# Altium project PV Refridgerator.PrjPCB
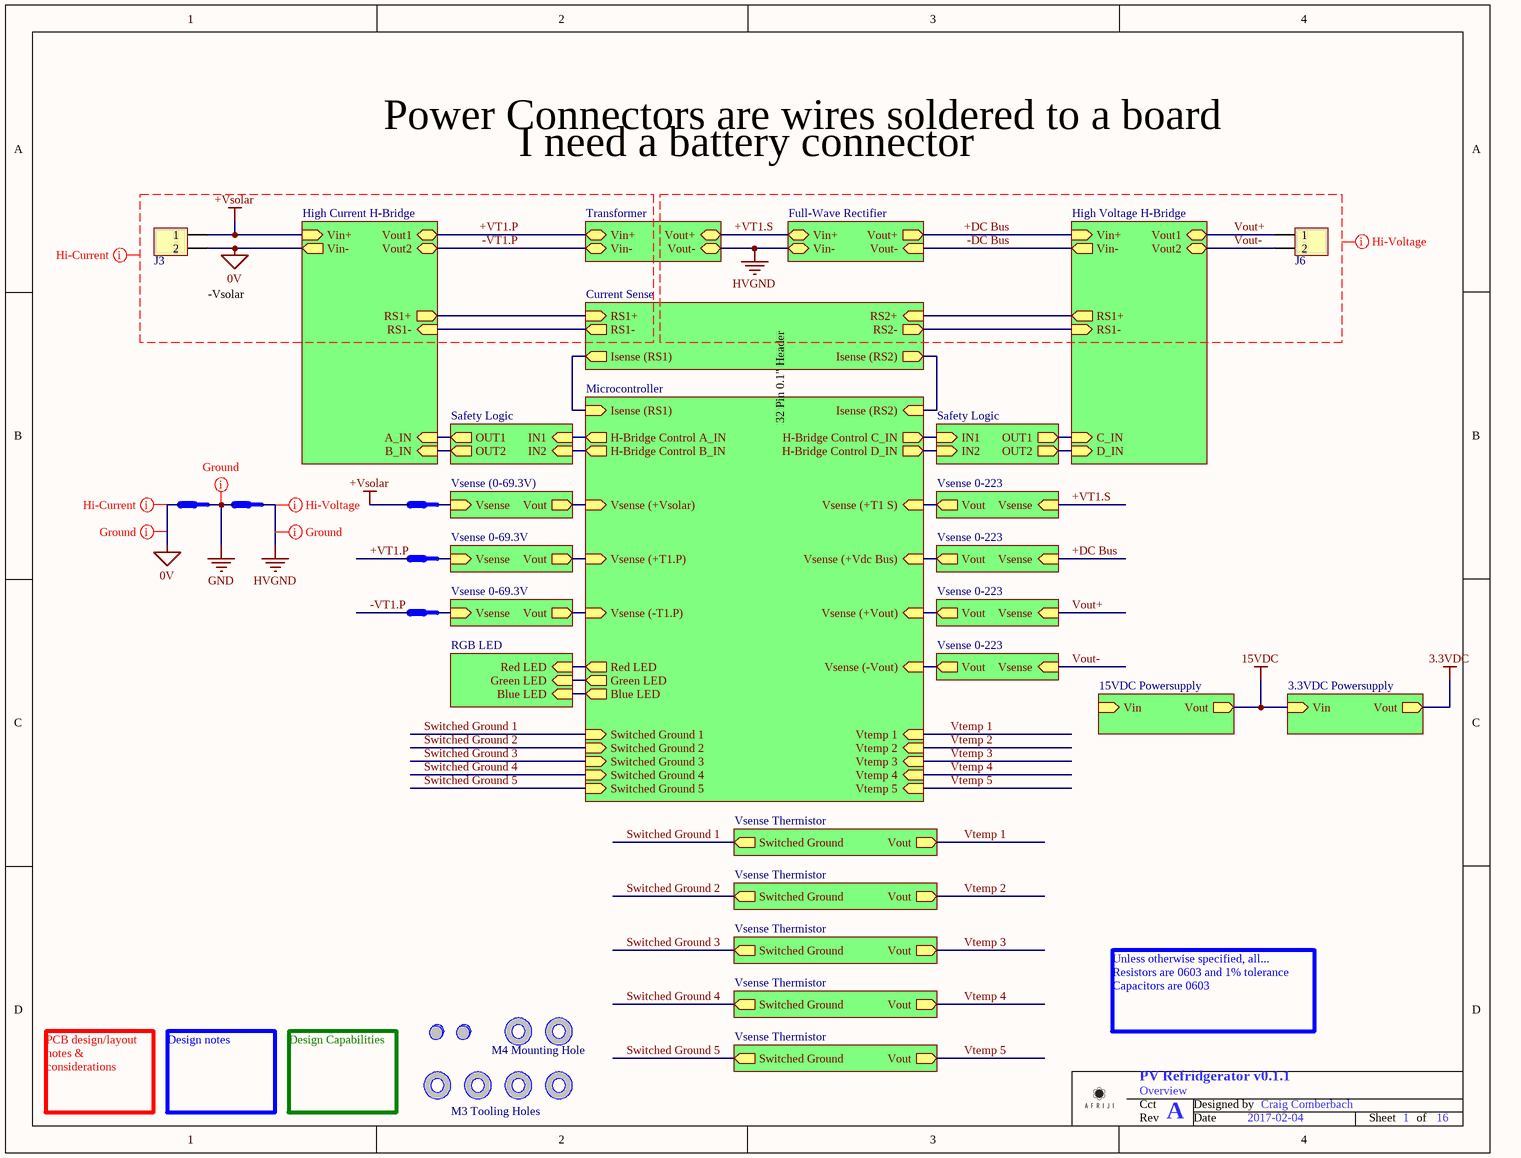
[diagram p0: Overview.SchDoc]
Designer: Craig Comberbach; ProjectRevision: v0.1.1; ProjectTitle: PV Refridgerator
8 sheets, 62 parts. Net scope: hierarchical (ports join the sheet entries above them; power ports are global).
Board file: PV Refridgerator v0.1.1.PCBDOC
Sheets:
  Overview.SchDoc
    High Current H-Bridge = High Current H-Bridge.SchDoc
    High Voltage H-Bridge = High Voltage H-Bridge.SchDoc
    3.3VDC Powersupply = 3.3VDC Powersupply.SchDoc
    Microcontroller = Microcontroller.SchDoc
      ICSP = ICSP.SchDoc
    15VDC Powersupply = 15VDC Powersupply.SchDoc
    Safety Logic = Safety Logic.SchDoc
    Safety Logic = Safety Logic.SchDoc

## Sheet Overview.SchDoc: Overview
size Letter; Date: 2017-02-04; DocumentNumber: 1; Revision: A; SheetNumber: 1; SheetTotal: 16; DesignedBy: Craig Comberbach

### Parts
FD1  Fiducial, Double Sided  [Fiducial - Double sided]  (value not drawn)
FD2  Fiducial, Double Sided  [Fiducial - Double sided]  (value not drawn)
J3  Terminal Block - 2-Position HiV/HiA  [TE 796739-2]  (value not drawn)
J6  Terminal Block - 2-Position HiV/HiA  [TE 796739-2]  (value not drawn)
MountingHole1  M3 Tooling Holes  [M3 Screw - One Sided]  (no BOM)
MountingHole2  Mounting Hole  [M3 Screw - One Sided]  (value not drawn)  (no BOM)
MountingHole3  Mounting Hole  [M4 Screw - One Sided]  (value not drawn)  (no BOM)
MountingHole4  M4 Mounting Hole  [M4 Screw - One Sided]  (no BOM)
MountingHole5  Mounting Hole  [M3 Screw - One Sided]  (value not drawn)  (no BOM)
MountingHole6  Mounting Hole  [M3 Screw - One Sided]  (value not drawn)  (no BOM)
NetTie2  Net Tie  [Net tie (7/50 mil)]  (value not drawn)  (net tie, no BOM)
NetTie3  Net Tie  [Net tie (7/7 mil)]  (value not drawn)  (net tie, no BOM)
NetTie7  Net Tie  [Net tie (7/7 mil)]  (value not drawn)  (net tie, no BOM)
NetTie8  Net Tie  [Net tie (7/7 mil)]  (value not drawn)  (net tie, no BOM)
NetTie9  Net Tie  [Net tie (7/7 mil)]  (value not drawn)  (net tie, no BOM)

### Sub-sheets
3.3VDC Powersupply = 3.3VDC Powersupply.SchDoc: Vin (in), Vout (out)
15VDC Powersupply = 15VDC Powersupply.SchDoc: Vin (in), Vout (out)
Current Sense = Current Sense.SchDoc (file not in this document): RS1+ (in), RS1- (out), RS2+ (in), RS2- (out), Isense (RS1) (out), Isense (RS2) (out)
Full-Wave Rectifier = Full-Wave Rectifier.SchDoc (file not in this document): Vin+ (bidir), Vin- (bidir), Vout+ (out), Vout- (in)
High Current H-Bridge = High Current H-Bridge.SchDoc: Vout1 (bidir), Vout2 (bidir), Vin+ (in), Vin- (out), A_IN (in), B_IN (in), RS1+ (out), RS1- (in)
High Voltage H-Bridge = High Voltage H-Bridge.SchDoc: Vout1 (bidir), Vout2 (bidir), Vin+ (in), Vin- (out), C_IN (in), D_IN (in), RS1+ (out), RS1- (in)
Microcontroller = Microcontroller.SchDoc: H-Bridge Control A_IN (out), H-Bridge Control B_IN (out), H-Bridge Control C_IN (out), H-Bridge Control D_IN (out), Red LED (out), Green LED (out), Blue LED (out), Vsense (+T1.P) (in), Vsense (+Vsolar) (in), Vsense (-T1.P) (in), Vsense (+T1 S) (in), Vsense (+Vdc Bus) (in), Vsense (+Vout) (in), Vsense (-Vout) (in), Vtemp 1 (in), Vtemp 2 (in), Vtemp 3 (in), Vtemp 4 (in), Vtemp 5 (in), Isense (RS1) (in), Isense (RS2) (in), Switched Ground 1 (in), Switched Ground 2 (in), Switched Ground 3 (in), Switched Ground 4 (in), Switched Ground 5 (in)
RGB LED = RGB LED.SchDoc (file not in this document): Red LED (in), Green LED (in), Blue LED (in)
Safety Logic = Safety Logic.SchDoc: IN1 (in), IN2 (in), OUT1 (out), OUT2 (out)
Safety Logic = Safety Logic.SchDoc: IN1 (in), IN2 (in), OUT1 (out), OUT2 (out)
Transformer = Transformer.SchDoc (file not in this document): Vin+ (bidir), Vin- (bidir), Vout+ (bidir), Vout- (bidir)
Vsense 0-69.3V = Vsense 0-69.3V.SchDoc (file not in this document): Vsense (in), Vout (out)
Vsense 0-69.3V = Vsense 0-69.3V.SchDoc (file not in this document): Vsense (in), Vout (out)
Vsense 0-223 = Vsense 0-223.3V.SchDoc (file not in this document): Vsense (in), Vout (out)
Vsense 0-223 = Vsense 0-223.3V.SchDoc (file not in this document): Vsense (in), Vout (out)
Vsense 0-223 = Vsense 0-223.3V.SchDoc (file not in this document): Vsense (in), Vout (out)
Vsense 0-223 = Vsense 0-223.3V.SchDoc (file not in this document): Vsense (in), Vout (out)
Vsense (0-69.3V) = Vsense 0-69.3V.SchDoc (file not in this document): Vsense (in), Vout (out)
Vsense Thermistor = Vsense Thermistor.SchDoc (file not in this document): Switched Ground (out), Vout (out)
Vsense Thermistor = Vsense Thermistor.SchDoc (file not in this document): Switched Ground (out), Vout (out)
Vsense Thermistor = Vsense Thermistor.SchDoc (file not in this document): Switched Ground (out), Vout (out)
Vsense Thermistor = Vsense Thermistor.SchDoc (file not in this document): Switched Ground (out), Vout (out)
Vsense Thermistor = Vsense Thermistor.SchDoc (file not in this document): Switched Ground (out), Vout (out)

### Nets
0V: J3.2 NetTie2.2 ; sheet High Current H-Bridge/Vin-, sheet High Current H-Bridge/RS1-, sheet Current Sense/RS1-
15VDC: sheet 3.3VDC Powersupply/Vin, sheet 15VDC Powersupply/Vout
+Vsolar: J3.1 NetTie7.2 ; sheet High Current H-Bridge/Vin+
GND: NetTie2.1 NetTie3.2
HVGND: NetTie3.1 ; sheet Full-Wave Rectifier/Vin-, sheet Transformer/Vout-
+DC Bus: sheet Full-Wave Rectifier/Vout+, sheet High Voltage H-Bridge/Vin+, sheet Vsense 0-223/Vsense
+VT1.P: NetTie8.2 ; sheet High Current H-Bridge/Vout1, sheet Transformer/Vin+
+VT1.S: sheet Full-Wave Rectifier/Vin+, sheet Transformer/Vout+, sheet Vsense 0-223/Vsense
-DC Bus: sheet Full-Wave Rectifier/Vout-, sheet High Voltage H-Bridge/Vin-, sheet High Voltage H-Bridge/RS1-, sheet Current Sense/RS2-
-VT1.P: NetTie9.2 ; sheet High Current H-Bridge/Vout2, sheet Transformer/Vin-
Switched Ground 1: sheet Microcontroller/Switched Ground 1, sheet Vsense Thermistor/Switched Ground
Switched Ground 2: sheet Microcontroller/Switched Ground 2, sheet Vsense Thermistor/Switched Ground
Switched Ground 3: sheet Microcontroller/Switched Ground 3, sheet Vsense Thermistor/Switched Ground
Switched Ground 4: sheet Microcontroller/Switched Ground 4, sheet Vsense Thermistor/Switched Ground
Switched Ground 5: sheet Microcontroller/Switched Ground 5, sheet Vsense Thermistor/Switched Ground
Vout+: J6.1 ; sheet High Voltage H-Bridge/Vout1, sheet Vsense 0-223/Vsense  [project net C_VS]
Vout-: J6.2 ; sheet High Voltage H-Bridge/Vout2, sheet Vsense 0-223/Vsense  [project net D_VS]
Vtemp 1: sheet Microcontroller/Vtemp 1, sheet Vsense Thermistor/Vout
Vtemp 2: sheet Microcontroller/Vtemp 2, sheet Vsense Thermistor/Vout
Vtemp 3: sheet Microcontroller/Vtemp 3, sheet Vsense Thermistor/Vout
Vtemp 4: sheet Microcontroller/Vtemp 4, sheet Vsense Thermistor/Vout
Vtemp 5: sheet Microcontroller/Vtemp 5, sheet Vsense Thermistor/Vout
NetNetTie7_1: NetTie7.1 ; sheet Vsense (0-69.3V)/Vsense
NetNetTie8_1: NetTie8.1 ; sheet Vsense 0-69.3V/Vsense
NetNetTie9_1: NetTie9.1 ; sheet Vsense 0-69.3V/Vsense
NetQ3_2: sheet High Current H-Bridge/RS1+, sheet Current Sense/RS1+
NetQ7_2: sheet High Voltage H-Bridge/RS1+, sheet Current Sense/RS2+
NetU1_4: sheet Microcontroller/H-Bridge Control C_IN, sheet Safety Logic/IN1
NetU1_5: sheet Microcontroller/H-Bridge Control D_IN, sheet Safety Logic/IN2
NetU1_14: sheet Microcontroller/Vsense (-T1.P), sheet Vsense 0-69.3V/Vout
NetU1_15: sheet Microcontroller/Vsense (+T1.P), sheet Vsense 0-69.3V/Vout
NetU1_16: sheet Microcontroller/Vsense (+Vsolar), sheet Vsense (0-69.3V)/Vout
NetU1_22: sheet Microcontroller/Isense (RS1), sheet Current Sense/Isense (RS1)
NetU1_23: sheet Microcontroller/Isense (RS2), sheet Current Sense/Isense (RS2)
NetU1_27: sheet Microcontroller/Vsense (+Vdc Bus), sheet Vsense 0-223/Vout
NetU1_28: sheet Microcontroller/Vsense (+T1 S), sheet Vsense 0-223/Vout
NetU1_29: sheet Microcontroller/Vsense (+Vout), sheet Vsense 0-223/Vout
NetU1_30: sheet Microcontroller/Vsense (-Vout), sheet Vsense 0-223/Vout
NetU1_43: sheet Microcontroller/Red LED, sheet RGB LED/Red LED
NetU1_44: sheet Microcontroller/Green LED, sheet RGB LED/Green LED
NetU1_45: sheet Microcontroller/Blue LED, sheet RGB LED/Blue LED
NetU1_52: sheet Microcontroller/H-Bridge Control A_IN, sheet Safety Logic/IN1
NetU1_53: sheet Microcontroller/H-Bridge Control B_IN, sheet Safety Logic/IN2
NetU3A_4: sheet High Current H-Bridge/A_IN, sheet Safety Logic/OUT1
NetU3B_4: sheet High Voltage H-Bridge/C_IN, sheet Safety Logic/OUT1
NetU7A_4: sheet High Current H-Bridge/B_IN, sheet Safety Logic/OUT2
NetU7B_4: sheet High Voltage H-Bridge/D_IN, sheet Safety Logic/OUT2

### Layout directives
net class 15A: 0V, +Vsolar, +VT1.P, -VT1.P
net class 171-250V: +DC Bus, +VT1.S, -DC Bus, HVGND, Vout+, Vout-
net class Grounds: 0V, GND, HVGND

### Notes on the sheet
- Power Connectors are wires soldered to a board
- I need a battery connector
- (near J3) -Vsolar
- 32 Pin 0.1" Header
- Unless otherwise specified, all...
  Resistors are 0603 and 1% tolerance
  Capacitors are 0603
- PCB design/layout notes & considerations
- Design notes
- Design Capabilities
- Cct
- Designed by
- Rev
- Date
- Sheet
- of

### Library data of the parts
J3 J6 = Terminal Block - 2-Position HiV/HiA: Manufacturer: TE Connectivity AMP Connectors; Manufacturer Part Number: 796739-2; Number of Levels: 1; Positions Per Level: 2; Pitch: 0.375" (9.53mm); Mating Orientation: Horizontal with Board; Current: 30A; Voltage: 600V; Wire Gauge: 10-30 AWG; Wire Termination: Screw - Rising Cage Clamp; Clamp Material - Plating: Brass - Nickel Plated; Torque - Screw: 0.79 Nm (7.0 Lb-In); Screw Thread: M3; Supplier 1: Digi-Key; RoHS: RoHS Compliant; Category: Connectors, Interconnects; Stock 1: 14124; Pricing 1: 1=2.21, 10=1.673, 25=1.5504, 50=1.394, 100=1.36, 250=1.19, 500=1.088, 1000=0.986, 2500=0.884 (USD); Packaging: Tray; Part Status: Active; Mounting Type: Through Hole; Features: Interlocking (Side); Color: Green; Operating Temperature: -; Housing Material: Polyamide (PA66), Nylon 6/6; Contact Material - Plating: -; Screw Material - Plating: Brass - Nickel Plated; ComponentLink1URL: http://www.te.com/commerce/DocumentDelivery/DDEController?Action=srchrtrv&DocNm=796739&DocType=Customer+Drawing&DocLang=English; ComponentLink1Description: Spec Sheet; Supplier Part Number 1: A98273-ND
MountingHole1 MountingHole4 = Mounting Hole
NetTie2 NetTie3 NetTie7-NetTie9 = Net Tie: Ties two nets together
FD1 FD2 = Fiducial, Double Sided: Technology: Mechanical

## Sheet High Current H-Bridge.SchDoc: High Current H-Bridge
size Letter; Date: 2017-01-26; DocumentNumber: 2; Revision: A; SheetNumber: 2; SheetTotal: 16; DesignedBy: Mike MacKay
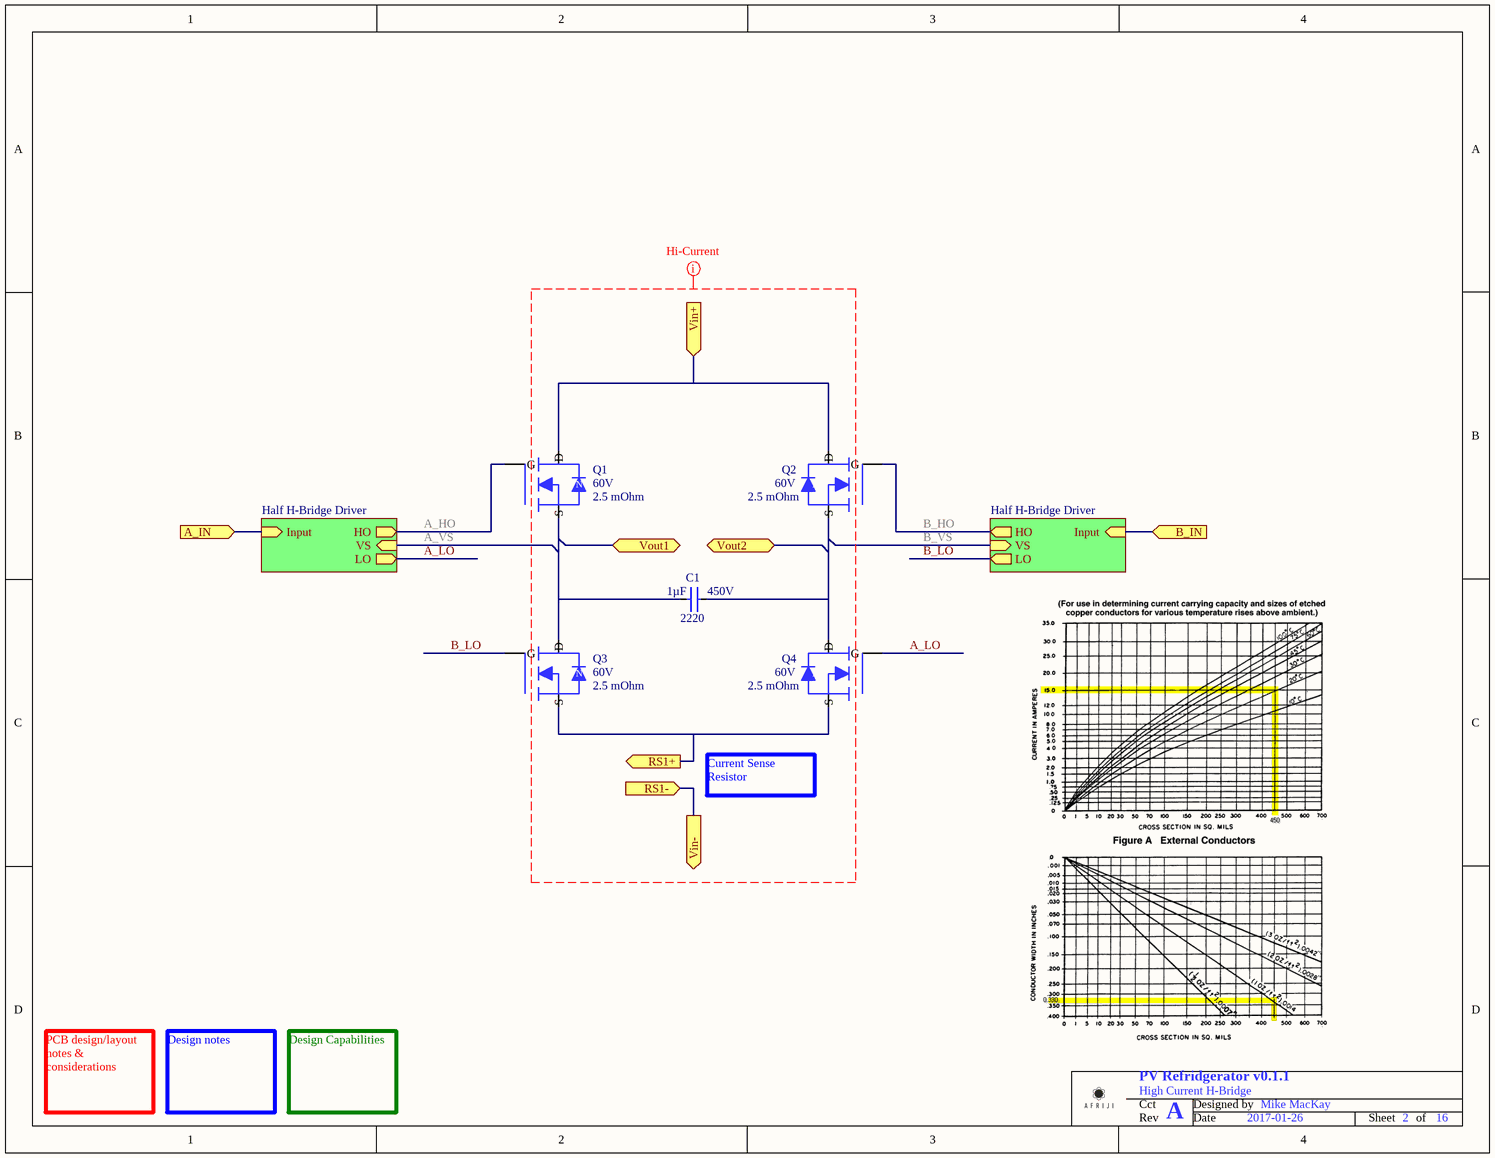
[diagram p1: High Current H-Bridge.SchDoc]

### Parts
C1  Capacitance: 1µF  Voltage - Rated: 450V  Package / Case: 2220  [C2220 - Ceramic]  (hidden comment: 1uF 2220 450V)
Q1  Drain to Source Voltage (Vdss): 60V  Rds On (Max) @ Id, Vgs: 2.5 mOhm  [DPAK]  (hidden comment: N-MOSFET - 66A/25V)
Q2  Drain to Source Voltage (Vdss): 60V  Rds On (Max) @ Id, Vgs: 2.5 mOhm  [DPAK]  (hidden comment: N-MOSFET - 66A/25V)
Q3  Drain to Source Voltage (Vdss): 60V  Rds On (Max) @ Id, Vgs: 2.5 mOhm  [DPAK]  (hidden comment: N-MOSFET - 66A/25V)
Q4  Drain to Source Voltage (Vdss): 60V  Rds On (Max) @ Id, Vgs: 2.5 mOhm  [DPAK]  (hidden comment: N-MOSFET - 66A/25V)

### Sub-sheets
Half H-Bridge Driver = Half H-Bridge Driver.SchDoc (file not in this document): HO (out), VS (in), LO (out), Input (in)
Half H-Bridge Driver = Half H-Bridge Driver.SchDoc (file not in this document): HO (out), VS (in), LO (out), Input (in)

### Ports
A_IN (in), B_IN (in), RS1+ (out), RS1- (in), Vin+ (in), Vin- (out), Vout1 (bidir), Vout2 (bidir)

### Nets
0V: port Vin-, port RS1-
+Vsolar: Q1.3(D) Q2.3(D) ; port Vin+
A_HO: Q1.1(G) ; sheet Half H-Bridge Driver/HO
A_LO: Q4.1(G) ; sheet Half H-Bridge Driver/LO
A_VS: C1.1 Q1.2(S) Q3.3(D) ; port Vout1, sheet Half H-Bridge Driver/VS  [project net +VT1.P]
B_HO: Q2.1(G) ; sheet Half H-Bridge Driver/HO
B_LO: Q3.1(G) ; sheet Half H-Bridge Driver/LO
B_VS: C1.2 Q2.2(S) Q4.3(D) ; port Vout2, sheet Half H-Bridge Driver/VS  [project net -VT1.P]
NetQ3_2: Q3.2(S) Q4.2(S) ; port RS1+
NetU3A_4: port A_IN, sheet Half H-Bridge Driver/Input
NetU7A_4: port B_IN, sheet Half H-Bridge Driver/Input

### Layout directives
net class 15A: (no net found under the mark)

### Notes on the sheet
- Current Sense Resistor
- PCB design/layout notes & considerations
- Design notes
- Design Capabilities
- Cct
- Designed by
- Rev
- Date
- Sheet
- of
- (in symbol N-MOSFET - 66A/25V) N

### Library data of the parts
C1 = 1uF 2220 450V: Manufacturer: TDK Corporation; Manufacturer Part Number: CGA9P4X7T2W105M250KE; Tolerance: ±20%; Temperature Coefficient: X7T; Supplier 1: Digi-Key; Supplier Part Number 1: 445-7998-1-ND; RoHS: RoHS Compliant; Category: Capacitors; Stock 1: 10247; Pricing 1: 1=3.11, 10=2.576, 100=2.1589, 250=1.78012 (USD); Packaging: Cut Tape (CT); Part Status: Active; Operating Temperature: -55°C ~ 125°C; Features: Soft Termination; Ratings: AEC-Q200; Applications: Automotive, Boardflex Sensitive; Failure Rate: -; Mounting Type: Surface Mount, MLCC; Size / Dimension: 0.224" L x 0.197" W (5.70mm x 5.00mm); Height - Seated (Max): -; Thickness (Max): 0.098" (2.50mm); Lead Spacing: -; Lead Style: -; ComponentLink1URL: https://product.tdk.com/info/en/catalog/datasheets/mlcc_automotive_soft_en.pdf; ComponentLink1Description: Spec Sheet; Value: 1uF 2220 450V
Q1-Q4 = N-MOSFET - 66A/25V: Manufacturer: Infineon Technologies; Manufacturer Part Number: IPD025N06N; FET Type: N-Channel; Current - Continuous Drain (Id) @ 25°C: 90A; Drive Voltage (Max Rds On,  Min Rds On): 6V, 10V; Vgs(th) (Max) @ Id: 2.8V @ 95µA; Gate Charge (Qg) (Max) @ Vgs: 71nC @ 10V; Input Capacitance (Ciss) (Max) @ Vds: 5200pF @ 30V; Vgs (Max): ±20V; Power Dissipation (Max): 3W (Ta), 167W (Tc); Supplier 1: Digi-Key; Supplier Part Number 1: IPD025N06NCT-ND; RoHS: RoHS Compliant; Category: Discrete Semiconductor Products; Stock 1: 5405; Pricing 1: 1=1.91, 10=1.72, 100=1.3822, 500=1.13558, 1000=0.94091 (USD); Packaging: Cut Tape (CT); Part Status: Active; Technology: MOSFET (Metal Oxide); FET Feature: -; Operating Temperature: -55°C ~ 175°C (TJ); Mounting Type: Surface Mount; Supplier Device Package: PG-TO252-3; Package / Case: TO-252-3, DPak (2 Leads + Tab), SC-63; ComponentLink1URL: http://www.infineon.com/dgdl/IPD025N06N_Rev2+1.pdf?folderId=db3a304313b8b5a60113cee8763b02d7&fileId=db3a304336415dec0136531648062c76; ComponentLink1Description: Spec Sheet

## Sheet High Voltage H-Bridge.SchDoc: High Voltage H-Bridge
size Letter; Date: 2017-01-26; DocumentNumber: 7; Revision: A; SheetNumber: 7; SheetTotal: 16; DesignedBy: Mike MacKay
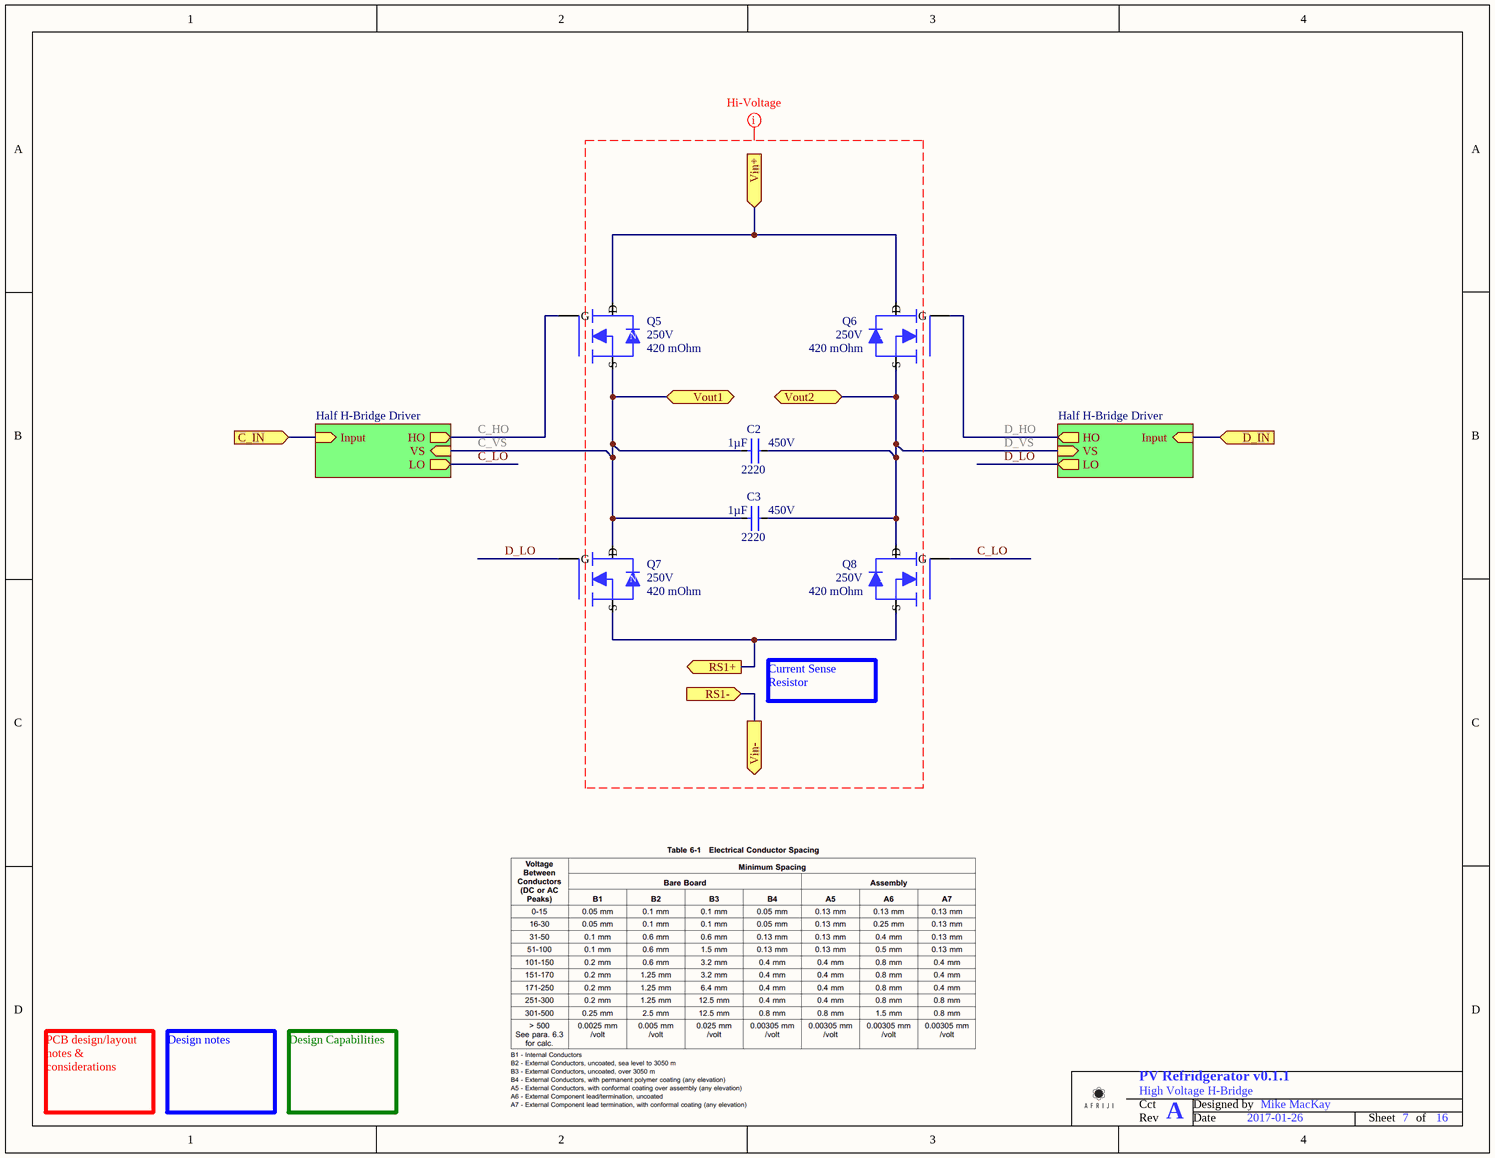
[diagram p2: High Voltage H-Bridge.SchDoc]

### Parts
C2  Capacitance: 1µF  Voltage - Rated: 450V  Package / Case: 2220  [C2220 - Ceramic]  (hidden comment: 1uF 2220 450V)
C3  Capacitance: 1µF  Voltage - Rated: 450V  Package / Case: 2220  [C2220 - Ceramic]  (hidden comment: 1uF 2220 450V)
Q5  Drain to Source Voltage (Vdss): 250V  Rds On (Max) @ Id, Vgs: 420 mOhm  [DPAK]  (hidden comment: N-MOSFET - 66A/25V)
Q6  Drain to Source Voltage (Vdss): 250V  Rds On (Max) @ Id, Vgs: 420 mOhm  [DPAK]  (hidden comment: N-MOSFET - 66A/25V)
Q7  Drain to Source Voltage (Vdss): 250V  Rds On (Max) @ Id, Vgs: 420 mOhm  [DPAK]  (hidden comment: N-MOSFET - 66A/25V)
Q8  Drain to Source Voltage (Vdss): 250V  Rds On (Max) @ Id, Vgs: 420 mOhm  [DPAK]  (hidden comment: N-MOSFET - 66A/25V)

### Sub-sheets
Half H-Bridge Driver = Half H-Bridge Driver.SchDoc (file not in this document): HO (out), VS (in), LO (out), Input (in)
Half H-Bridge Driver = Half H-Bridge Driver.SchDoc (file not in this document): HO (out), VS (in), LO (out), Input (in)

### Ports
C_IN (in), D_IN (in), RS1+ (out), RS1- (in), Vin+ (in), Vin- (out), Vout1 (bidir), Vout2 (bidir)

### Nets
+DC Bus: Q5.3(D) Q6.3(D) ; port Vin+
-DC Bus: port Vin-, port RS1-
C_HO: Q5.1(G) ; sheet Half H-Bridge Driver/HO
C_LO: Q8.1(G) ; sheet Half H-Bridge Driver/LO
C_VS: C2.1 C3.1 Q5.2(S) Q7.3(D) ; port Vout1, sheet Half H-Bridge Driver/VS
D_HO: Q6.1(G) ; sheet Half H-Bridge Driver/HO
D_LO: Q7.1(G) ; sheet Half H-Bridge Driver/LO
D_VS: C2.2 C3.2 Q6.2(S) Q8.3(D) ; port Vout2, sheet Half H-Bridge Driver/VS
NetQ7_2: Q7.2(S) Q8.2(S) ; port RS1+
NetU3B_4: port C_IN, sheet Half H-Bridge Driver/Input
NetU7B_4: port D_IN, sheet Half H-Bridge Driver/Input

### Layout directives
net class 171-250V: (no net found under the mark)

### Notes on the sheet
- Current Sense Resistor
- PCB design/layout notes & considerations
- Design notes
- Design Capabilities
- Cct
- Designed by
- Rev
- Date
- Sheet
- of
- (in symbol N-MOSFET - 66A/25V) N

### Library data of the parts
C2 C3 = 1uF 2220 450V: as C1 on sheet High Current H-Bridge; Supplier 1: Digi-Key; Supplier Part Number 1: 445-7998-1-ND; RoHS: RoHS Compliant; Category: Capacitors; Stock 1: 10247; Pricing 1: 1=3.11, 10=2.576, 100=2.1589, 250=1.78012 (USD); Packaging: Cut Tape (CT); Part Status: Active; Operating Temperature: -55°C ~ 125°C; Features: Soft Termination; Ratings: AEC-Q200; Applications: Automotive, Boardflex Sensitive; Failure Rate: -; Mounting Type: Surface Mount, MLCC; Size / Dimension: 0.224" L x 0.197" W (5.70mm x 5.00mm); Height - Seated (Max): -; Thickness (Max): 0.098" (2.50mm); Lead Spacing: -; Lead Style: -; ComponentLink1URL: https://product.tdk.com/info/en/catalog/datasheets/mlcc_automotive_soft_en.pdf; ComponentLink1Description: Spec Sheet; Value: 1uF 2220 450V
Q5-Q8 = N-MOSFET - 66A/25V: Manufacturer: Fairchild/ON Semiconductor; Manufacturer Part Number: FQD9N25TM; FET Type: N-Channel; Current - Continuous Drain (Id) @ 25°C: 7.4A (Tc); Drive Voltage (Max Rds On,  Min Rds On): 10V; Vgs(th) (Max) @ Id: 5V @ 250µA; Gate Charge (Qg) (Max) @ Vgs: 20nC @ 10V; Input Capacitance (Ciss) (Max) @ Vds: 700pF @ 25V; Vgs (Max): ±30V; Power Dissipation (Max): 2.5W (Ta), 55W (Tc); Supplier 1: Digi-Key; Supplier Part Number 1: FQD9N25TMCT-ND; RoHS: RoHS Compliant; Category: Discrete Semiconductor Products; Stock 1: 4941; Pricing 1: 1=0.86, 10=0.766, 100=0.597, 500=0.49316, 1000=0.38934 (USD); Packaging: Cut Tape (CT); Part Status: Active; Technology: MOSFET (Metal Oxide); FET Feature: -; Operating Temperature: -55°C ~ 150°C (TJ); Mounting Type: Surface Mount; Supplier Device Package: D-Pak; Package / Case: TO-252-3, DPak (2 Leads + Tab), SC-63; ComponentLink1URL: https://www.fairchildsemi.com/datasheets/FQ/FQD9N25.pdf; ComponentLink1Description: Spec Sheet

## Sheet 3.3VDC Powersupply.SchDoc: 3.3VDC Powersupply
size Letter; Date: 2017-02-10; DocumentNumber: 9; Revision: A; SheetNumber: 9; SheetTotal: 16; DesignedBy: Craig Comberbach
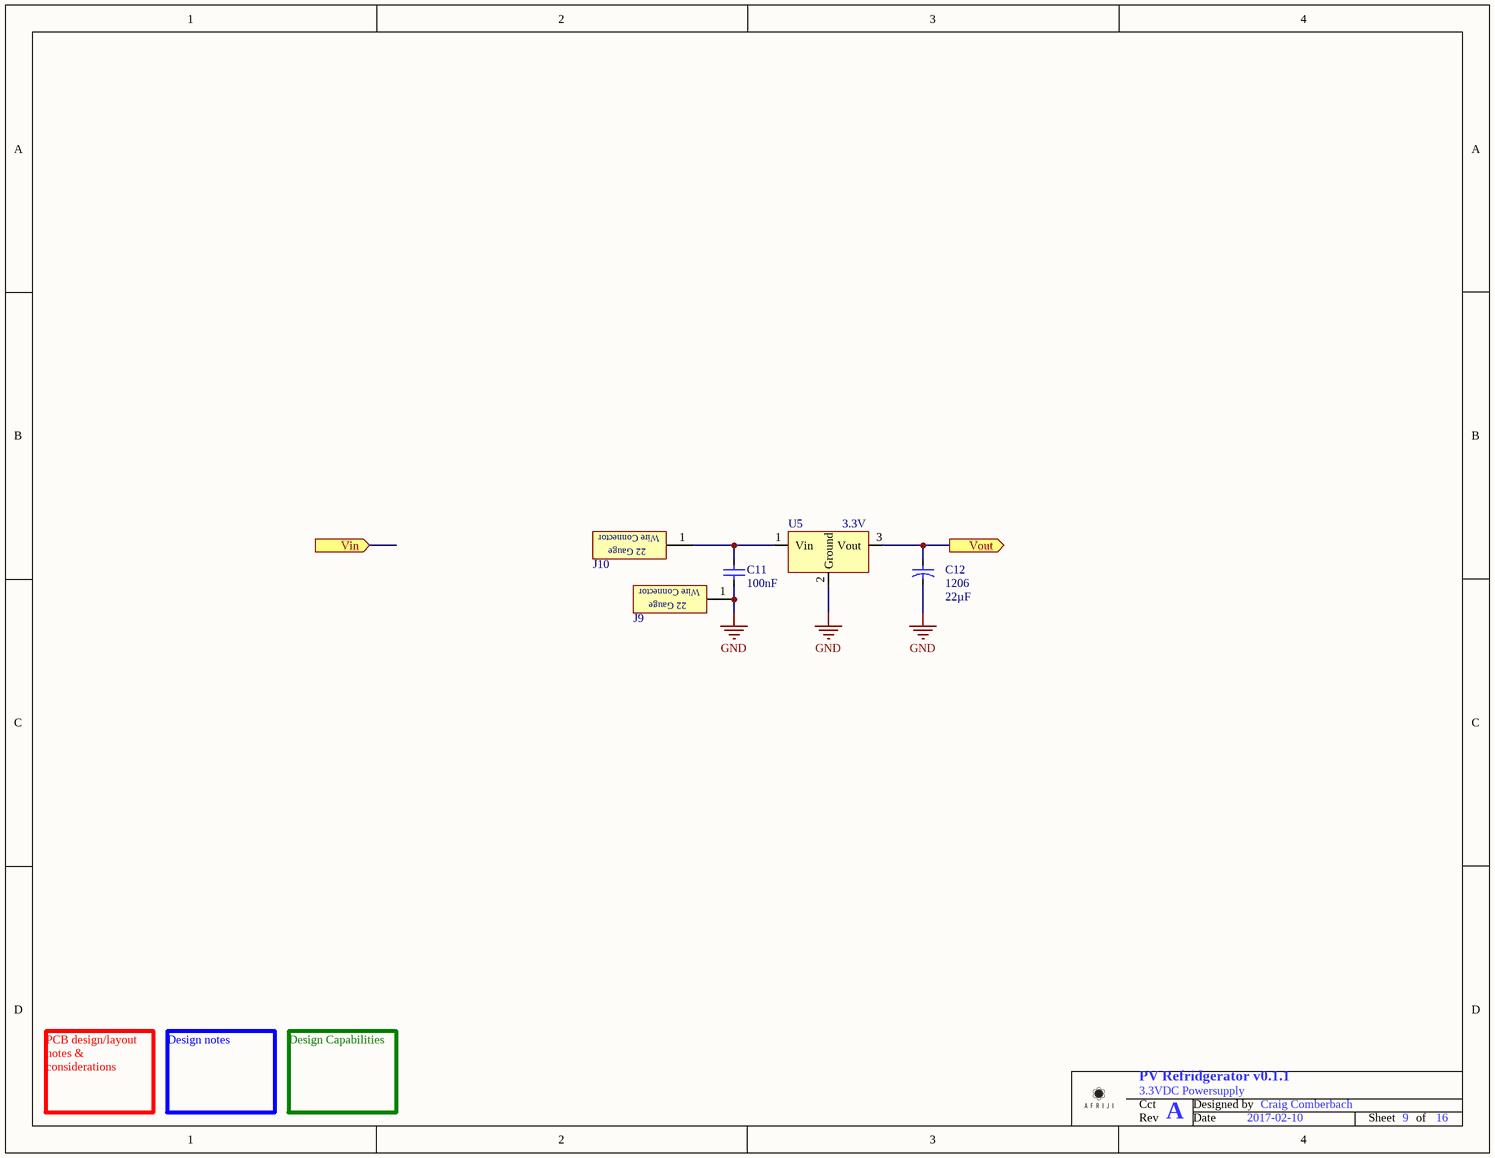
[diagram p3: 3.3VDC Powersupply.SchDoc]

### Parts
C11  Capacitance: 100nF  [Capacitor - 0603 Ceramic]  (hidden comment: 100nF 0603 50V)
C12  1206  Capacitance: 22µF  [Capacitor - 1210 Tantalum]
J9  GND  [1 Pin 22-Gauge Wire Connector]  (value not drawn)  (no BOM)
J10  3.3VDC  [1 Pin 22-Gauge Wire Connector]  (value not drawn)  (no BOM)
U5  Voltage - Output: 3.3V  [SOT223]  (hidden comment: 3.3V Linear Voltage Regulator LDO)

### Ports
Vin (in), Vout (out)

### Nets
3.3VDC: C12.1 U5.3(Vout) ; port Vout
GND: C11.2 C12.2 J9.1 U5.2(Ground)
NetC11_1: C11.1 J10.1 U5.1(Vin)

### Notes on the sheet
- PCB design/layout notes & considerations
- Design notes
- Design Capabilities
- Cct
- Designed by
- Rev
- Date
- Sheet
- of
- (in symbol 1 Pin 22-Gauge Wire connector) Wire Connector; 22 Gauge

### Library data of the parts
C11 = 100nF 0603 50V: Non-polarized; Manufacturer: Murata Electronics North America; Manufacturer Part Number: GRM188R71H104KA93D; Value: 100 nF 50V 0603 XR7 10%; Tolerance: ±10%; Temperature Coefficient: X7R; Technology: SMT; Supplier 1: Digi-Key; Supplier Part Number 1: 490-1519-1-ND; RoHS: RoHS Compliant; Category: Capacitors; Stock 1: 4132110; Pricing 1: 1=0.12, 10=0.048, 50=0.0256, 100=0.0218, 250=0.01776, 500=0.0152, 1000=0.01185 (CAD); Packaging: Cut Tape (CT); Voltage - Rated: 50V; Mounting Type: Surface Mount, MLCC; Operating Temperature: -55°C ~ 125°C; Applications: General Purpose; Ratings: -; Package / Case: 0603 (1608 Metric); Size / Dimension: 0.063" L x 0.031" W (1.60mm x 0.80mm); Height - Seated (Max): -; Thickness (Max): 0.035" (0.90mm); Lead Spacing: -; Features: -; Lead Style: -; ComponentLink1URL: http://www.murata.com/products/catalog/pdf/c02e.pdf; ComponentLink1Description: Spec Sheet
C12 = 22uF 1210 10V - Tantalum: Polarized; Manufacturer: AVX Corporation; Manufacturer Part Number: TAJB226K010RNJ; Manufacturer Size Code: B; Value: 22 uF 10V 1210 Tantalum; Tolerance: ±10%; Voltage - Rated: 10V; ESR (Equivalent Series Resistance): 2.4 Ohm; Type: Molded; Technology: SMT; Supplier 1: Digi-Key; Supplier Part Number 1: 478-3039-1-ND; RoHS: RoHS Compliant; Category: Capacitors; Stock 1: 9403; Pricing 1: 1=0.92, 10=0.882, 100=0.428, 250=0.35556, 500=0.32264, 1000=0.29629 (CAD); Packaging: Cut Tape (CT); Operating Temperature: -55°C ~ 125°C; Mounting Type: Surface Mount; Package / Case: 1210 (3528 Metric); Size / Dimension: 0.138" L x 0.110" W (3.50mm x 2.80mm); Height - Seated (Max): 0.083" (2.10mm); Lead Spacing: -; Features: General Purpose; Lifetime @ Temp.: -; ComponentLink1URL: http://www.avx.com/docs/Catalogs/taj.pdf; ComponentLink1Description: Spec Sheet
J9 J10 = 1 Pin 22-Gauge Wire connector
U5 = 3.3V Linear Voltage Regulator LDO: 500mA; Manufacturer: Micrel Inc; Manufacturer Part Number: MIC5209-3.3YS TR; Regulator Topology: Positive Fixed; Voltage - Dropout (Typical): 0.35V @ 500mA; Number of Regulators: 1; Voltage - Input: Up to 16V; Technology: SMT; Value: 3.3V Linear Voltage Regulator LDO; Supplier 1: Digi-Key; Supplier Part Number 1: 576-1274-1-ND; RoHS: RoHS Compliant; Category: Integrated Circuits (ICs); Stock 1: 13773; Pricing 1: 1=2.1, 10=1.871, 25=1.6516, 100=1.4864, 250=1.29364, 500=1.15602, 1000=0.9083 (CAD); Packaging: Cut Tape (CT); Current - Output: 500mA; Current - Limit (Min): -; Operating Temperature: -40°C ~ 125°C; Mounting Type: Surface Mount; Package / Case: TO-261-4, TO-261AA; Supplier Device Package: SOT-223; ComponentLink1URL: http://www.micrel.com/_PDF/mic5209.pdf; ComponentLink1Description: Spec Sheet

## Sheet Microcontroller.SchDoc: Microcontroller
size Letter; Date: 2017-02-04; DocumentNumber: 10; Revision: A; SheetNumber: 10; SheetTotal: 16; DesignedBy: Craig Comberbach
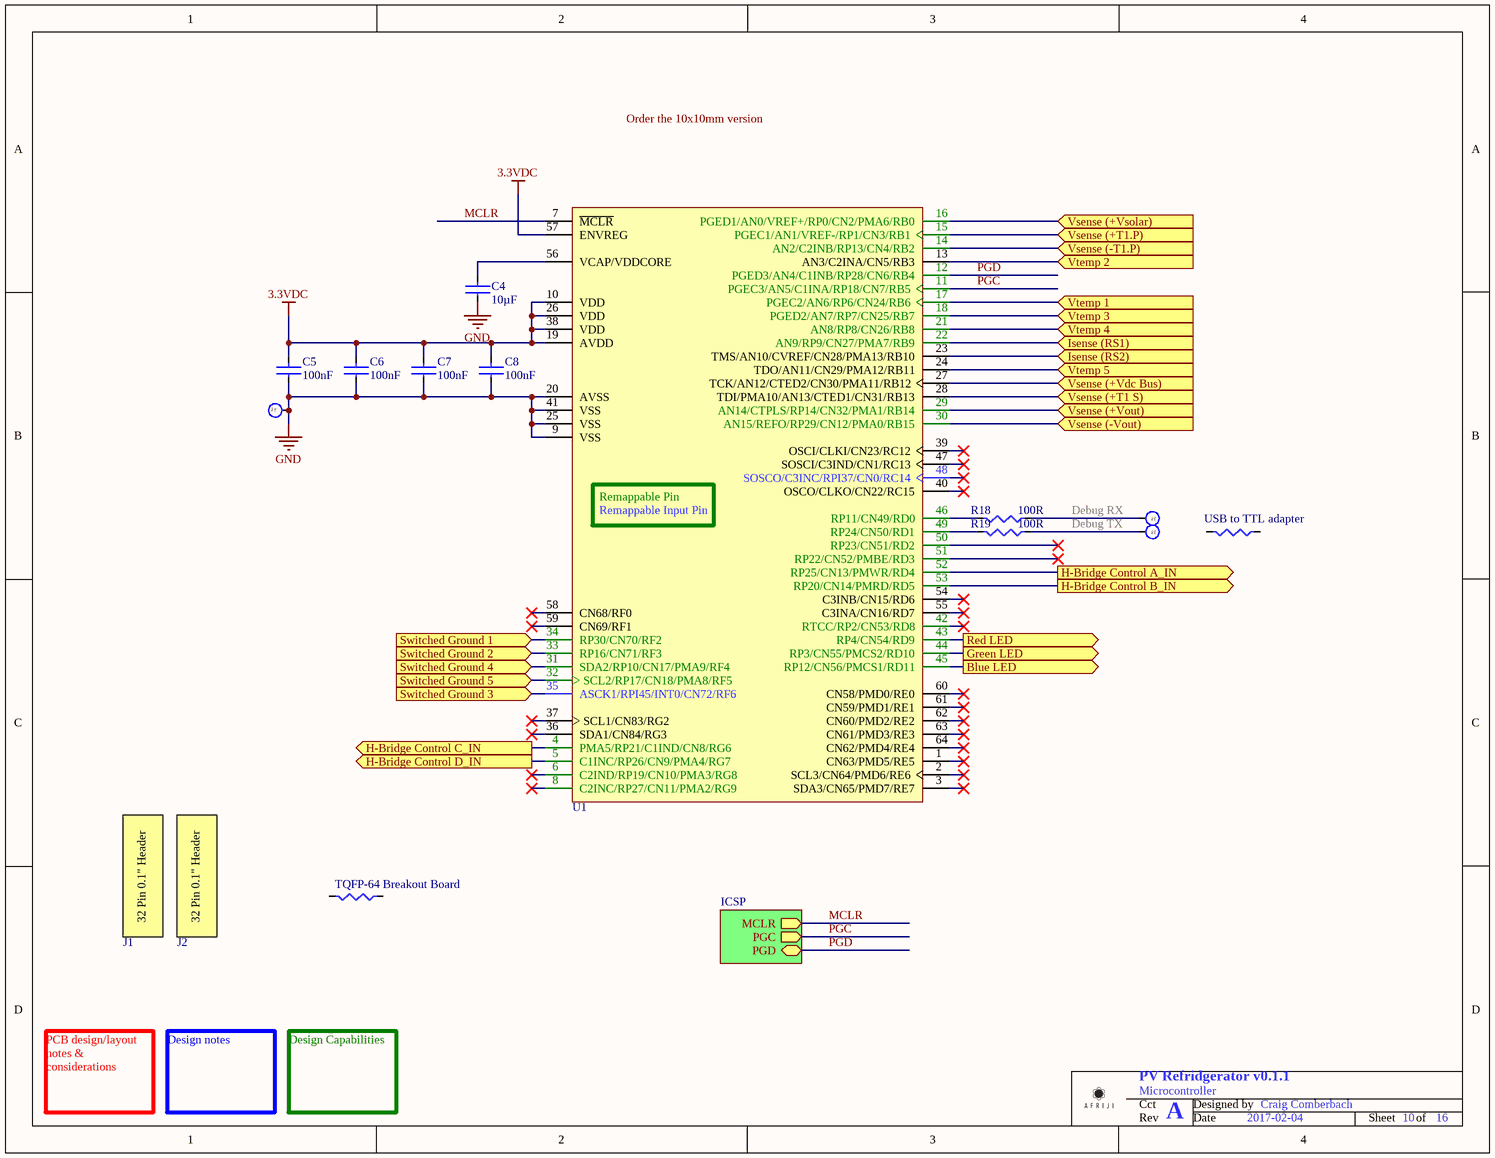
[diagram p4: Microcontroller.SchDoc]

### Parts
C4  Capacitance: 10µF  [C0805 - Ceramic]  (hidden comment: 10uF 0805 10V)
C5  Capacitance: 100nF  [C0603 - Ceramic]  (hidden comment: 100nF 0603 50V)
C6  Capacitance: 100nF  [C0603 - Ceramic]  (hidden comment: 100nF 0603 50V)
C7  Capacitance: 100nF  [C0603 - Ceramic]  (hidden comment: 100nF 0603 50V)
C8  Capacitance: 100nF  [C0603 - Ceramic]  (hidden comment: 100nF 0603 50V)
J1  32-Pin 0.1" Header  (value not drawn)  (mechanical)
J2  32-Pin 0.1" Header  (value not drawn)  (mechanical)
R18  Resistance (Ohms): 100R  [R0603]  (hidden comment: 100R 0603 1%)
R19  Resistance (Ohms): 100R  [R0603]  (hidden comment: 100R 0603 1%)
TP1  Test Clip  [SMT Test Clip]  (value not drawn)
TP2  Test Clip  [SMT Test Clip]  (value not drawn)
TP3  Test Clip  [SMT Test Clip]  (value not drawn)
TQFP-64_Breakout_Board  1k 1210 1%  (value not drawn)  (mechanical)
U1  PIC24FJ256GA106 Microprocessor  [TQFP-64 0.5mm Breakout Board]  (value not drawn)
USB_to_TTL_Serial_3.3V  USB to TTL adapter  (mechanical)

### Sub-sheets
ICSP = ICSP.SchDoc: MCLR (out), PGD (bidir), PGC (out)

### Ports
Blue LED (out), Green LED (out), H-Bridge Control A_IN (out), H-Bridge Control B_IN (out), H-Bridge Control C_IN (out), H-Bridge Control D_IN (out), Isense (RS1) (in), Isense (RS2) (in), Red LED (out), Switched Ground 1 (in), Switched Ground 2 (in), Switched Ground 3 (in), Switched Ground 4 (in), Switched Ground 5 (in), Vsense (+T1 S) (in), Vsense (+T1.P) (in), Vsense (+Vdc Bus) (in), Vsense (+Vout) (in), Vsense (+Vsolar) (in), Vsense (-T1.P) (in), Vsense (-Vout) (in), Vtemp 1 (in), Vtemp 2 (in), Vtemp 3 (in), Vtemp 4 (in), Vtemp 5 (in)

### Nets
3.3VDC: C5.1 C6.1 C7.1 C8.1 U1.10(VDD) U1.19(AVDD) U1.26(VDD) U1.38(VDD) U1.57(ENVREG)
GND: C4.2 C5.2 C6.2 C7.2 C8.2 TP1.1 U1.9(VSS) U1.20(AVSS) U1.25(VSS) U1.41(VSS)
Debug RX: R18.2 TP2.1
Debug TX: R19.2 TP3.1
MCLR: U1.7(~{MCLR}) ; sheet ICSP/MCLR
PGC: U1.11(PGEC3/AN5/C1INA/RP18/CN7/RB5) ; sheet ICSP/PGC
PGD: U1.12(PGED3/AN4/C1INB/RP28/CN6/RB4) ; sheet ICSP/PGD
Switched Ground 1: U1.34(RP30/CN70/RF2) ; port Switched Ground 1
Switched Ground 2: U1.33(RP16/CN71/RF3) ; port Switched Ground 2
Switched Ground 3: U1.35(ASCK1/RPI45/INT0/CN72/RF6) ; port Switched Ground 3
Switched Ground 4: U1.31(SDA2/RP10/CN17/PMA9/RF4) ; port Switched Ground 4
Switched Ground 5: U1.32(SCL2/RP17/CN18/PMA8/RF5) ; port Switched Ground 5
Vtemp 1: U1.17(PGEC2/AN6/RP6/CN24/RB6) ; port Vtemp 1
Vtemp 2: U1.13(AN3/C2INA/CN5/RB3) ; port Vtemp 2
Vtemp 3: U1.18(PGED2/AN7/RP7/CN25/RB7) ; port Vtemp 3
Vtemp 4: U1.21(AN8/RP8/CN26/RB8) ; port Vtemp 4
Vtemp 5: U1.24(TDO/AN11/CN29/PMA12/RB11) ; port Vtemp 5
NetC4_1: C4.1 U1.56(VCAP/VDDCORE)
NetR18_1: R18.1 U1.46(RP11/CN49/RD0)
NetR19_1: R19.1 U1.49(RP24/CN50/RD1)
NetU1_4: U1.4(PMA5/RP21/C1IND/CN8/RG6) ; port H-Bridge Control C_IN
NetU1_5: U1.5(C1INC/RP26/CN9/PMA4/RG7) ; port H-Bridge Control D_IN
NetU1_14: U1.14(AN2/C2INB/RP13/CN4/RB2) ; port Vsense (-T1.P)
NetU1_15: U1.15(PGEC1/AN1/VREF-/RP1/CN3/RB1) ; port Vsense (+T1.P)
NetU1_16: U1.16(PGED1/AN0/VREF+/RP0/CN2/PMA6/RB0) ; port Vsense (+Vsolar)
NetU1_22: U1.22(AN9/RP9/CN27/PMA7/RB9) ; port Isense (RS1)
NetU1_23: U1.23(TMS/AN10/CVREF/CN28/PMA13/RB10) ; port Isense (RS2)
NetU1_27: U1.27(TCK/AN12/CTED2/CN30/PMA11/RB12) ; port Vsense (+Vdc Bus)
NetU1_28: U1.28(TDI/PMA10/AN13/CTED1/CN31/RB13) ; port Vsense (+T1 S)
NetU1_29: U1.29(AN14/CTPLS/RP14/CN32/PMA1/RB14) ; port Vsense (+Vout)
NetU1_30: U1.30(AN15/REFO/RP29/CN12/PMA0/RB15) ; port Vsense (-Vout)
NetU1_43: U1.43(RP4/CN54/RD9) ; port Red LED
NetU1_44: U1.44(RP3/CN55/PMCS2/RD10) ; port Green LED
NetU1_45: U1.45(RP12/CN56/PMCS1/RD11) ; port Blue LED
NetU1_52: U1.52(RP25/CN13/PMWR/RD4) ; port H-Bridge Control A_IN
NetU1_53: U1.53(RP20/CN14/PMRD/RD5) ; port H-Bridge Control B_IN

Not connected (* = marked no-connect by the designer): TQFP-64_Breakout_Board 1 2; U1 1(CN63/PMD5/RE5)* 2(SCL3/CN64/PMD6/RE6)* 3(SDA3/CN65/PMD7/RE7)* 6(C2IND/RP19/CN10/PMA3/RG8)* 8(C2INC/RP27/CN11/PMA2/RG9)* 36(SDA1/CN84/RG3)* 37(SCL1/CN83/RG2)* 39(OSCI/CLKI/CN23/RC12)* 40(OSCO/CLKO/CN22/RC15)* 42(RTCC/RP2/CN53/RD8)* 47(SOSCI/C3IND/CN1/RC13)* 48(SOSCO/C3INC/RPI37/CN0/RC14)* 50(RP23/CN51/RD2)* 51(RP22/CN52/PMBE/RD3)* 54(C3INB/CN15/RD6)* 55(C3INA/CN16/RD7)* 58(CN68/RF0)* 59(CN69/RF1)* 60(CN58/PMD0/RE0)* 61(CN59/PMD1/RE1)* 62(CN60/PMD2/RE2)* 63(CN61/PMD3/RE3)* 64(CN62/PMD4/RE4)*; USB_to_TTL_Serial_3.3V 1 2

### Notes on the sheet
- PCB design/layout notes & considerations
- Design notes
- Design Capabilities
- Cct
- Designed by
- Rev
- Date
- Sheet
- of
- Labels drawn without touching a wire or pin: Order the 10x10mm version
- (in symbol 32-Pin 0.1" Header) 32 Pin 0.1" Header
- (in symbol PIC24FJ256GA106 Microprocessor) Remappable Pin; Remappable Input Pin
- (in symbol Test Clip) Clip; Test

### Library data of the parts
C4 = 10uF 0805 10V: Manufacturer: Kemet; Manufacturer Part Number: C0805C106K8PACTU; Tolerance: ±10%; Temperature Coefficient: X5R; Value: 10uF 0805 10V; Supplier 1: Digi-Key; RoHS: RoHS Compliant; Category: Capacitors; Stock 1: 215894; Pricing 1: 1=0.21, 10=0.14, 50=0.085, 100=0.0714, 250=0.0578, 500=0.051, 1000=0.04335 (USD); Packaging: Cut Tape (CT); Voltage - Rated: 10V; Mounting Type: Surface Mount, MLCC; Operating Temperature: -55°C ~ 85°C; Applications: General Purpose; Ratings: -; Package / Case: 0805 (2012 Metric); Size / Dimension: 0.079" L x 0.049" W (2.00mm x 1.25mm); Height - Seated (Max): -; Thickness (Max): 0.055" (1.40mm); Lead Spacing: -; Features: -; Lead Style: -; ComponentLink1URL: http://www.kemet.com/docfinder?Partnumber=C0805C106K8PACTU; ComponentLink1Description: Spec Sheet; Supplier Part Number 1: 399-4925-1-ND
C5-C8 = 100nF 0603 50V: Manufacturer: Samsung Electro-Mechanics America, Inc; Manufacturer Part Number: CL10B104KB8SFNC; Tolerance: ±10%; Temperature Coefficient: X7R; Value: 100nF 0603 50V; Supplier 1: Digi-Key; RoHS: RoHS Compliant; Category: Capacitors; Stock 1: 1192070; Pricing 1: 1=0.1, 10=0.027, 25=0.0192, 100=0.0125, 500=0.00874, 1000=0.00681 (USD); Packaging: Cut Tape (CT); Voltage - Rated: 50V; Mounting Type: Surface Mount, MLCC; Operating Temperature: -55°C ~ 125°C; Applications: Boardflex Sensitive; Ratings: -; Package / Case: 0603 (1608 Metric); Size / Dimension: 0.063" L x 0.031" W (1.60mm x 0.80mm); Height - Seated (Max): -; Thickness (Max): 0.035" (0.90mm); Lead Spacing: -; Features: Soft Termination; Lead Style: -; ComponentLink1URL: http://www.samsungsem.com/kr/front/downloadcms.do?path=/kr/support/product-search/mlcc/__icsFiles/afieldfile/2014/11/05&fileName=S_CL10B104KB8SFNC.pdf; ComponentLink1Description: Spec Sheet; Supplier Part Number 1: 1276-1936-1-ND
J1 J2 = 32-Pin 0.1" Header: Manufacturer: Wurth Electronics Inc; Manufacturer Part Number: 61303211821; Style: Board to Board; Number of Positions: 32; Number of Positions Loaded: All; Pitch - Mating: 0.100" (2.54mm); Contact Length - Post: 0.122" (3.10mm); Material Flammability Rating: UL94 V-0; Current Rating: 3A; Voltage Rating: 250VAC; Supplier 1: Digi-Key; RoHS: RoHS Compliant; Category: Connectors, Interconnects; Stock 1: 332; Pricing 1: 1=1.86, 10=1.788, 50=1.65, 100=1.5125, 500=1.375 (USD); Packaging: Tray; Part Status: Active; Connector Type: Header; Contact Type: Forked; Number of Rows: 1; Row Spacing - Mating: -; Mounting Type: Through Hole; Termination: Solder; Fastening Type: Push-Pull; Contact Finish - Mating: Gold; Contact Finish Thickness - Mating: -; Insulation Color: Black; Insulation Height: 0.335" (8.51mm); Operating Temperature: -40°C ~ 105°C; Contact Finish - Post: Gold; Mated Stacking Heights: -; Ingress Protection: -; Features: -; Applications: -; Insulation Material: Polybutylene Terephthalate (PBT); Contact Shape: Square; Contact Material: Copper Alloy; Contact Finish Thickness - Post: -; ComponentLink1URL: http://katalog.we-online.de/em/datasheet/6130xx11821.pdf; ComponentLink1Description: Spec Sheet; Supplier Part Number 1: 732-2860-ND
R18 R19 = 100R 0603 1%: 1/8W; Manufacturer: Yageo; Manufacturer Part Number: RC0603FR-07100RL; Power (Watts): 0.1W, 1/10W; Temperature Coefficient: ±100ppm/°C; Value: 100R 0603 1%; Supplier 1: Digi-Key; RoHS: RoHS Compliant; Category: Resistors; Stock 1: 2116183; Pricing 1: 1=0.1, 10=0.015, 25=0.0108, 100=0.006, 250=0.00456, 500=0.00364, 1000=0.00268, 2500=0.00233 (USD); Packaging: Cut Tape (CT); Tolerance: ±1%; Composition: Thick Film; Features: Moisture Resistant; Operating Temperature: -55°C ~ 155°C; Package / Case: 0603 (1608 Metric); Supplier Device Package: 0603; Size / Dimension: 0.063" L x 0.031" W (1.60mm x 0.80mm); Height: 0.022" (0.55mm); Number of Terminations: 2; ComponentLink1URL: http://www.yageo.com/NewPortal/yageodocoutput?fileName=/pdf/R-Chip/PYu-RC_Group_51_RoHS_L_0.pdf; ComponentLink1Description: http://www.yageo.com/NewPortal/yageodocoutput?fileName=/pdf/R-Chip/PYu-RC_Group_51_RoHS_L_0.pdf; Supplier Part Number 1: 311-100HRCT-ND
TP1-TP3 = Test Clip: Manufacturer: TE Connectivity AMP Connectors; Manufacturer Part Number: RCU-0C; Value: SMT Test Clip; Material - Insulation: No Insulation; Technology: SMT; Supplier 1: Digi-Key; RoHS: RoHS Compliant; Category: Test and Measurement; Stock 1: 58926; Pricing 1: 1=0.31, 10=0.291, 25=0.248, 50=0.217, 100=0.2014, 250=0.1782, 500=0.17046, 1000=0.13947 (CAD); Packaging: Cut Tape (CT); Part Status: Active; Type: PC Test Point; Mounting Type: Surface Mount; Color: Natural; Size / Dimension: 0.063" x 0.031" x 0.045" (1.60mm x 0.80mm x 1.15mm); Plating: -; Material - Body: -; ComponentLink1URL: http://www.te.com/commerce/DocumentDelivery/DDEController?Action=srchrtrv&DocNm=1773266&DocType=DS&DocLang=English; ComponentLink1Description: Spec Sheet; Supplier Part Number 1: A106145CT-ND
TQFP-64_Breakout_Board = 1k 1210 1%: 1/8W; Manufacturer: Chip Quik Inc.; Manufacturer Part Number: PA0096; Value: TQFP-64 Breakout Board; Proto Board Type: SMD to DIP; Package Accepted: LQFP, TQFP, VQFP; Number of Positions: 64; Pitch: 0.020" (0.50mm); Board Thickness: 0.062" (1.57mm) 1/16"; Supplier 1: Digi-Key; Supplier Part Number 1: PA0096-ND; RoHS: RoHS Compliant; Category: Prototyping Products; Stock 1: 56; Pricing 1: 1=15.79 (USD); Part Status: Active; Hole Diameter: -; Material: FR4 Epoxy Glass; Size / Dimension: 1.000" x 3.200" (25.40mm x 81.28mm); ComponentLink1URL: http://www.chipquik.com/datasheets/PA0096.pdf; ComponentLink1Description: Spec Sheet
U1 = PIC24FJ256GA106 Microprocessor: General Purpose 16-Bit Flash Microcontroller, 256KB Flash, 16KB SRAM, 64-Pin TQFP, Industrial Temperature; Manufacturer: Microchip Technology; Manufacturer Part Number: PIC24FJ256GA106-I/PT; Core Processor: PIC; Speed: 32MHz; Connectivity: I²C, PMP, SPI, UART/USART; Peripherals: Brown-out Detect/Reset, LVD, POR, PWM, WDT; Number of I/O: 53; Program Memory Size: 256KB (85.5K x 24); RAM Size: 16K x 8; Voltage - Supply (Vcc/Vdd): 2 V ~ 3.6 V; Data Converters: A/D 16x10b; Oscillator Type: Internal; Value: PIC24FJ256GA106 Microprocessor; Technology: SMT; Supplier 1: Digi-Key; Supplier Part Number 1: PIC24FJ256GA106-I/PT-ND; RoHS: RoHS Compliant; Category: Integrated Circuits (ICs); Stock 1: 6379; Pricing 1: 1=7.45, 10=6.201, 25=5.6864, 100=5.1477 (CAD); Packaging: Tray; Core Size: 16-Bit; Program Memory Type: FLASH; EEPROM Size: -; Operating Temperature: -40°C ~ 85°C; Package / Case: 64-TQFP; Supplier Device Package: 64-TQFP (10x10); ComponentLink1URL: http://www.microchip.com/mymicrochip/filehandler.aspx?ddocname=en534317; ComponentLink1Description: Spec Sheet
USB_to_TTL_Serial_3.3V = 1k 1210 1%: 1/8W; Manufacturer: FTDI, Future Technology Devices International Ltd; Manufacturer Part Number: TTL-232RG-VSW3V3-WE; Usage: USB to TTL Serial 3.3V; Convert From (Adapter End): USB - A, Plug; Convert To (Adapter End): Cable, 6 Wire Leads; Shielding: Unshielded; Supplier 1: Digi-Key; Supplier Part Number 1: 768-1072-ND; RoHS: RoHS Compliant; Category: Cable Assemblies; Stock 1: 1142; Pricing 1: 1=21.07, 10=18.32, 50=16.66, 100=16.2501, 250=15.48008 (USD); Part Status: Active; Length: 5.90' (1.80m); ComponentLink1URL: http://www.ftdichip.com/Support/Documents/DataSheets/Cables/DS_TTL-232RG_CABLES.pdf; ComponentLink1Description: http://www.ftdichip.com/Support/Documents/DataSheets/Cables/DS_TTL-232RG_CABLES.pdf

## Sheet ICSP.SchDoc: ICSP
size Letter; Date: 2017-02-06; DocumentNumber: 11; Revision: A; SheetNumber: 11; SheetTotal: 16; DesignedBy: Craig Comberbach
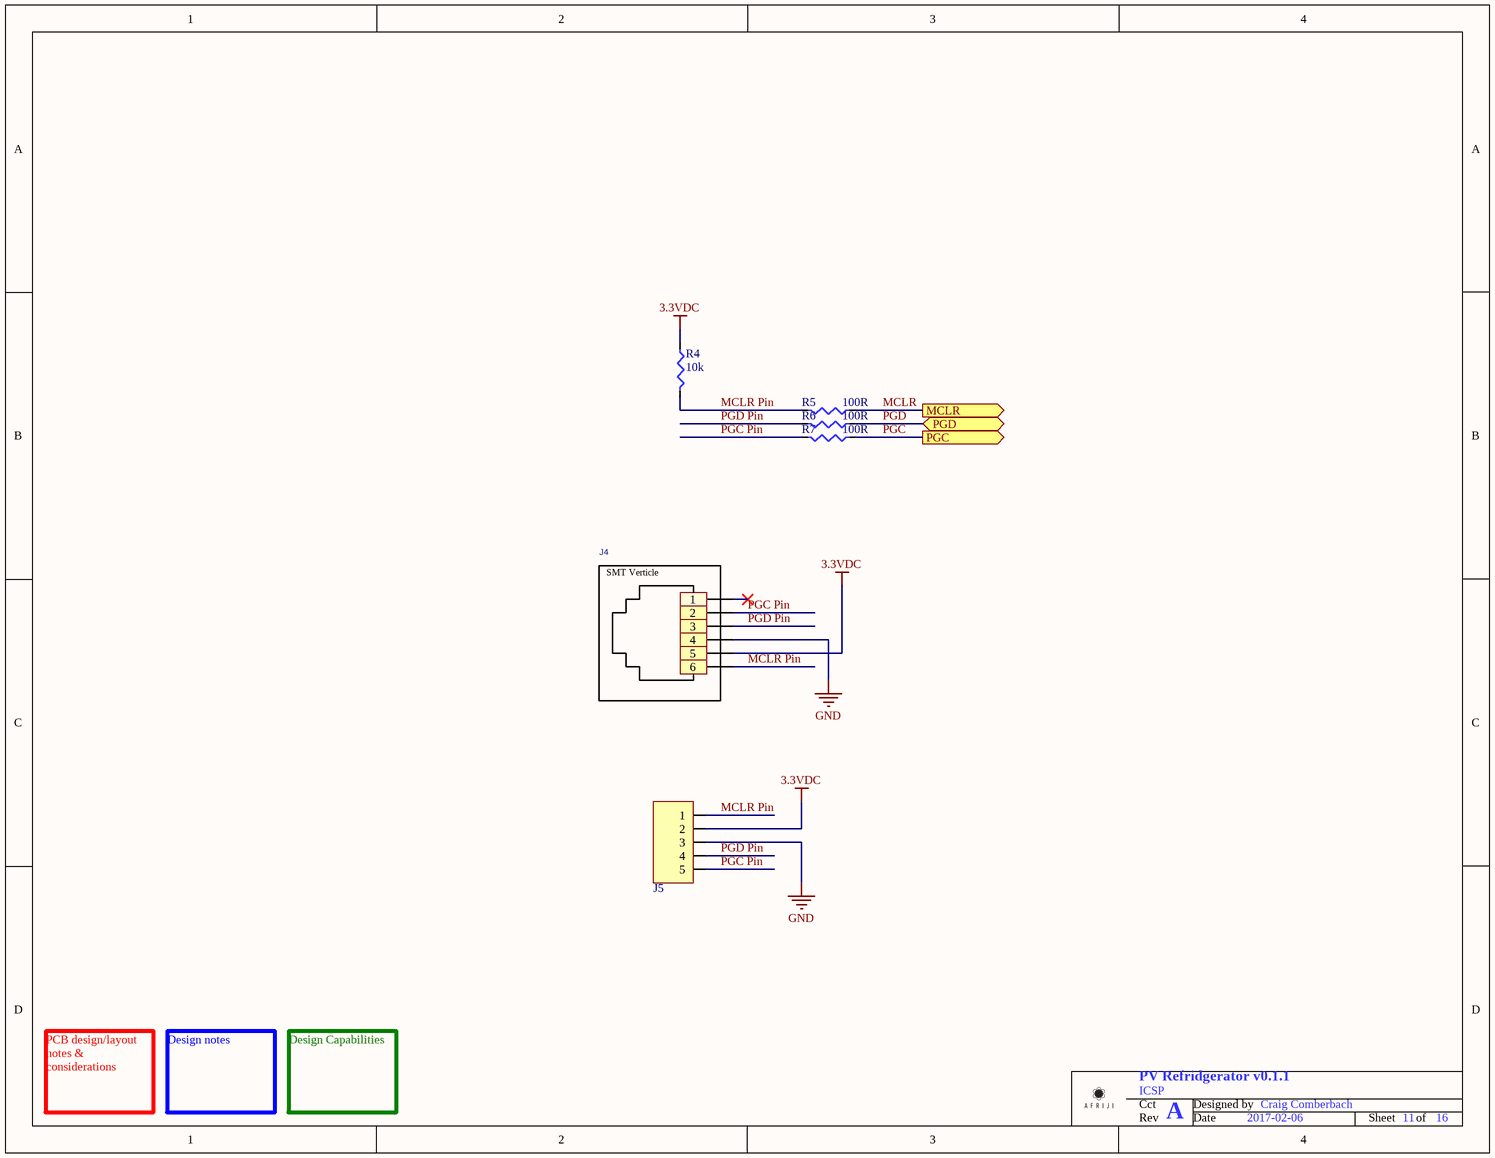
[diagram p5: ICSP.SchDoc]

### Parts
J4  RJ12 Verticle SMT  [Connector- RJ12 Vertical SMT]  (value not drawn)
J5  MTA100 - 5-Pin with friction Lock  [Connector - MTA-100 5 Position]  (value not drawn)
R4  Resistance (Ohms): 10k  [R0603]  (hidden comment: 10k 0603 1%)
R5  Resistance (Ohms): 100R  [R0603]  (hidden comment: 100R 0603 1%)
R6  Resistance (Ohms): 100R  [R0603]  (hidden comment: 100R 0603 1%)
R7  Resistance (Ohms): 100R  [R0603]  (hidden comment: 100R 0603 1%)

### Ports
MCLR (out), PGC (out), PGD (bidir)

### Nets
3.3VDC: J4.5 J5.2 R4.1
GND: J4.4 J5.3
MCLR: R5.2 ; port MCLR
MCLR Pin: J4.6 J5.1 R4.2 R5.1
PGC: R7.2 ; port PGC
PGC Pin: J4.2 J5.5 R7.1
PGD: R6.2 ; port PGD
PGD Pin: J4.3 J5.4 R6.1

Not connected (* = marked no-connect by the designer): J4 1*

### Notes on the sheet
- PCB design/layout notes & considerations
- Design notes
- Design Capabilities
- Cct
- Designed by
- Rev
- Date
- Sheet
- of
- (in symbol RJ12 Verticle SMT) SMT Verticle

### Library data of the parts
J4 = RJ12 Verticle SMT: Manufacturer: Molex Inc; Manufacturer Part Number: 0855135114; Connector Type: Jack; Number of Positions/Contacts: 6p6c (RJ11, RJ12, RJ14, RJ25); Number of Ports: 1; Shielding: Unshielded; Ratings: Cat3; LED Color: Does Not Contain LED; Tab Direction: User Selectable; Value: SMT RJ12 Verticle; Technology: SMT; Supplier 1: Digi-Key; RoHS: RoHS Compliant; Category: Connectors, Interconnects; Stock 1: 760; Pricing 1: 1=2.12, 10=1.869, 50=1.6858, 100=1.6124 (CAD); Packaging: Cut Tape (CT); Number of Rows: 1; Mounting Type: Surface Mount; Orientation: Vertical; Termination: Solder; Features: Pick and Place Cap, Solder Retention; Ingress Protection: -; Contact Material: Copper Alloy; Contact Finish: Gold; Contact Finish Thickness: -; Housing Material: Liquid Crystal Polymer (LCP), Glass Filled; Operating Temperature: -40°C ~ 85°C; ComponentLink1URL: http://www.literature.molex.com/SQLImages/kelmscott/Molex/PDF_Images/987651-0729.pdf; ComponentLink1Description: Spec Sheet; Supplier Part Number 1: WM10468CT-ND
J5 = MTA100 - 5-Pin with friction Lock: Flash Programmer; Manufacturer: TE Connectivity; Manufacturer Part Number: 640456-5; Connector Type: Header, Unshrouded; Number of Positions: 5; Number of Positions Loaded: All; Pitch: 0.100" (2.54mm); Supplier 1: Digi-Key; Supplier Part Number 1: A19471-ND; RoHS: RoHS Compliant; Category: Connectors, Interconnects; Stock 1: 38829; Pricing 1: 1=0.34, 10=0.314, 50=0.2286, 100=0.2197, 250=0.1972, 500=0.18824, 1000=0.15687, 2500=0.14343, 5000=0.13446 (CAD); Packaging: Bulk; Contact Type: Male Pin; Number of Rows: 1; Row Spacing: -; Contact Mating Length: 0.295" (7.49mm); Mounting Type: Through Hole; Termination: Solder; Fastening Type: Friction Lock; Features: -; Contact Finish: Tin; Contact Finish Thickness: -; Color: Natural; ComponentLink1URL: http://www.te.com/commerce/DocumentDelivery/DDEController?Action=srchrtrv&DocNm=640456&DocType=Customer+Drawing&DocLang=English; ComponentLink1Description: Spec Sheet; Technology: THT; Value: MTA100 - 5-Pin with friction Lock
R4 = 10k 0603 1%: Resistor; Manufacturer: Yageo; Manufacturer Part Number: RC0603FR-0710KL; Power (Watts): 0.1W, 1/10W; Temperature Coefficient: ±100ppm/°C; Value: 10k 0603 1%; Supplier 1: Digi-Key; RoHS: RoHS Compliant; Category: Resistors; Stock 1: 5171799; Pricing 1: 1=0.1, 10=0.015, 25=0.0108, 100=0.006, 250=0.00456, 500=0.00364, 1000=0.00268, 2500=0.00233 (USD); Packaging: Cut Tape (CT); Tolerance: ±1%; Composition: Thick Film; Features: Moisture Resistant; Package / Case: 0603 (1608 Metric); Supplier Device Package: 0603; Size / Dimension: 0.063" L x 0.031" W (1.60mm x 0.80mm); Height: 0.022" (0.55mm); Number of Terminations: 2; ComponentLink1URL: http://www.yageo.com/NewPortal/yageodocoutput?fileName=/pdf/R-Chip/PYu-RC_Group_51_RoHS_L_0.pdf; ComponentLink1Description: http://www.yageo.com/NewPortal/yageodocoutput?fileName=/pdf/R-Chip/PYu-RC_Group_51_RoHS_L_0.pdf; Supplier Part Number 1: 311-10.0KHRCT-ND; Operating Temperature: -55°C ~ 155°C
R5-R7 = 100R 0603 1%: as R18 on sheet Microcontroller; Value: 100R 0603 1%; Supplier 1: Digi-Key; RoHS: RoHS Compliant; Category: Resistors; Stock 1: 2116183; Pricing 1: 1=0.1, 10=0.015, 25=0.0108, 100=0.006, 250=0.00456, 500=0.00364, 1000=0.00268, 2500=0.00233 (USD); Packaging: Cut Tape (CT); Tolerance: ±1%; Composition: Thick Film; Features: Moisture Resistant; Package / Case: 0603 (1608 Metric); Supplier Device Package: 0603; Size / Dimension: 0.063" L x 0.031" W (1.60mm x 0.80mm); Height: 0.022" (0.55mm); Number of Terminations: 2; ComponentLink1URL: http://www.yageo.com/NewPortal/yageodocoutput?fileName=/pdf/R-Chip/PYu-RC_Group_51_RoHS_L_0.pdf; ComponentLink1Description: http://www.yageo.com/NewPortal/yageodocoutput?fileName=/pdf/R-Chip/PYu-RC_Group_51_RoHS_L_0.pdf; Supplier Part Number 1: 311-100HRCT-ND; Operating Temperature: -55°C ~ 155°C

## Sheet 15VDC Powersupply.SchDoc: 3.3VDC Powersupply
size Letter; Date: 2017-02-04; DocumentNumber: 8; Revision: A; SheetNumber: 8; SheetTotal: 16; DesignedBy: Craig Comberbach
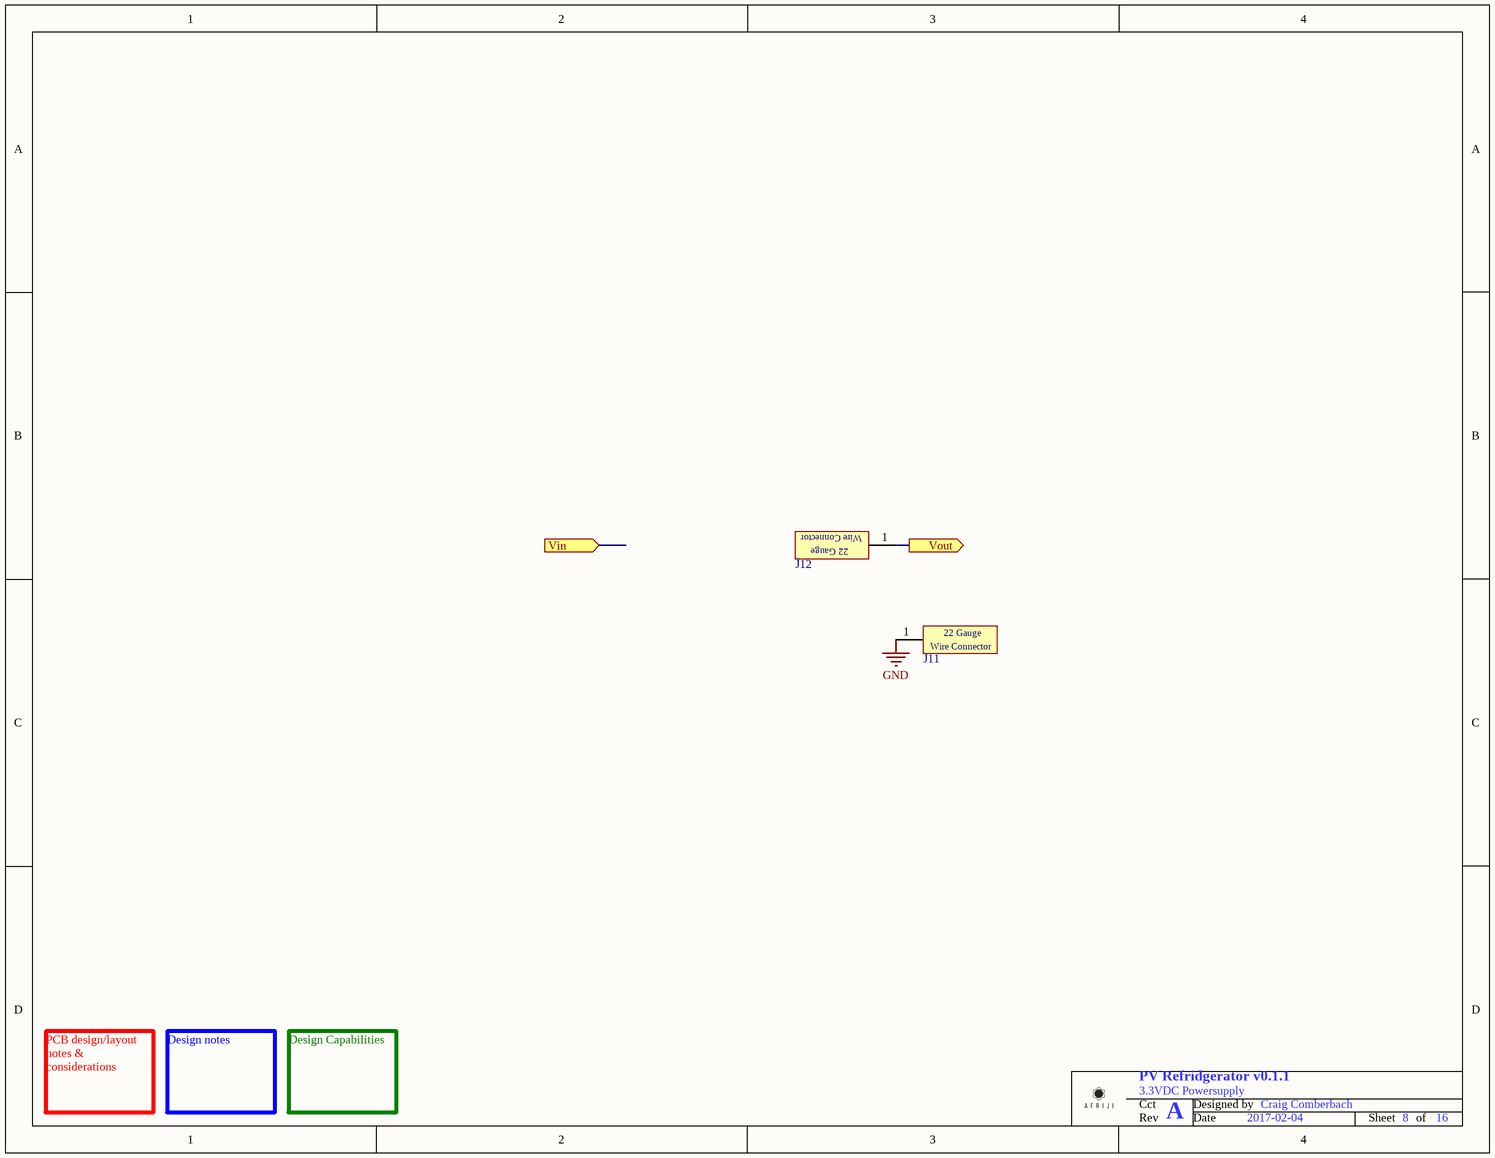
[diagram p6: 15VDC Powersupply.SchDoc]

### Parts
J11  GND  [1 Pin 22-Gauge Wire Connector]  (value not drawn)  (no BOM)
J12  15VDC  [1 Pin 22-Gauge Wire Connector]  (value not drawn)  (no BOM)

### Ports
Vin (in), Vout (out)

### Nets
15VDC: J12.1 ; port Vout
GND: J11.1

### Notes on the sheet
- PCB design/layout notes & considerations
- Design notes
- Design Capabilities
- Cct
- Designed by
- Rev
- Date
- Sheet
- of
- (in symbol 1 Pin 22-Gauge Wire connector) 22 Gauge; Wire Connector

### Library data of the parts
J11 J12 = 1 Pin 22-Gauge Wire connector

## Sheet Safety Logic.SchDoc: Safety Logic
size Letter; Date: 2017-02-10; DocumentNumber: 4; Revision: A; SheetNumber: 4; SheetTotal: 16; DesignedBy: Mike MacKay
Used 2 times, as channels Safety Logic, Safety Logic. Parts and nets are listed once, with the designators drawn on the sheet.
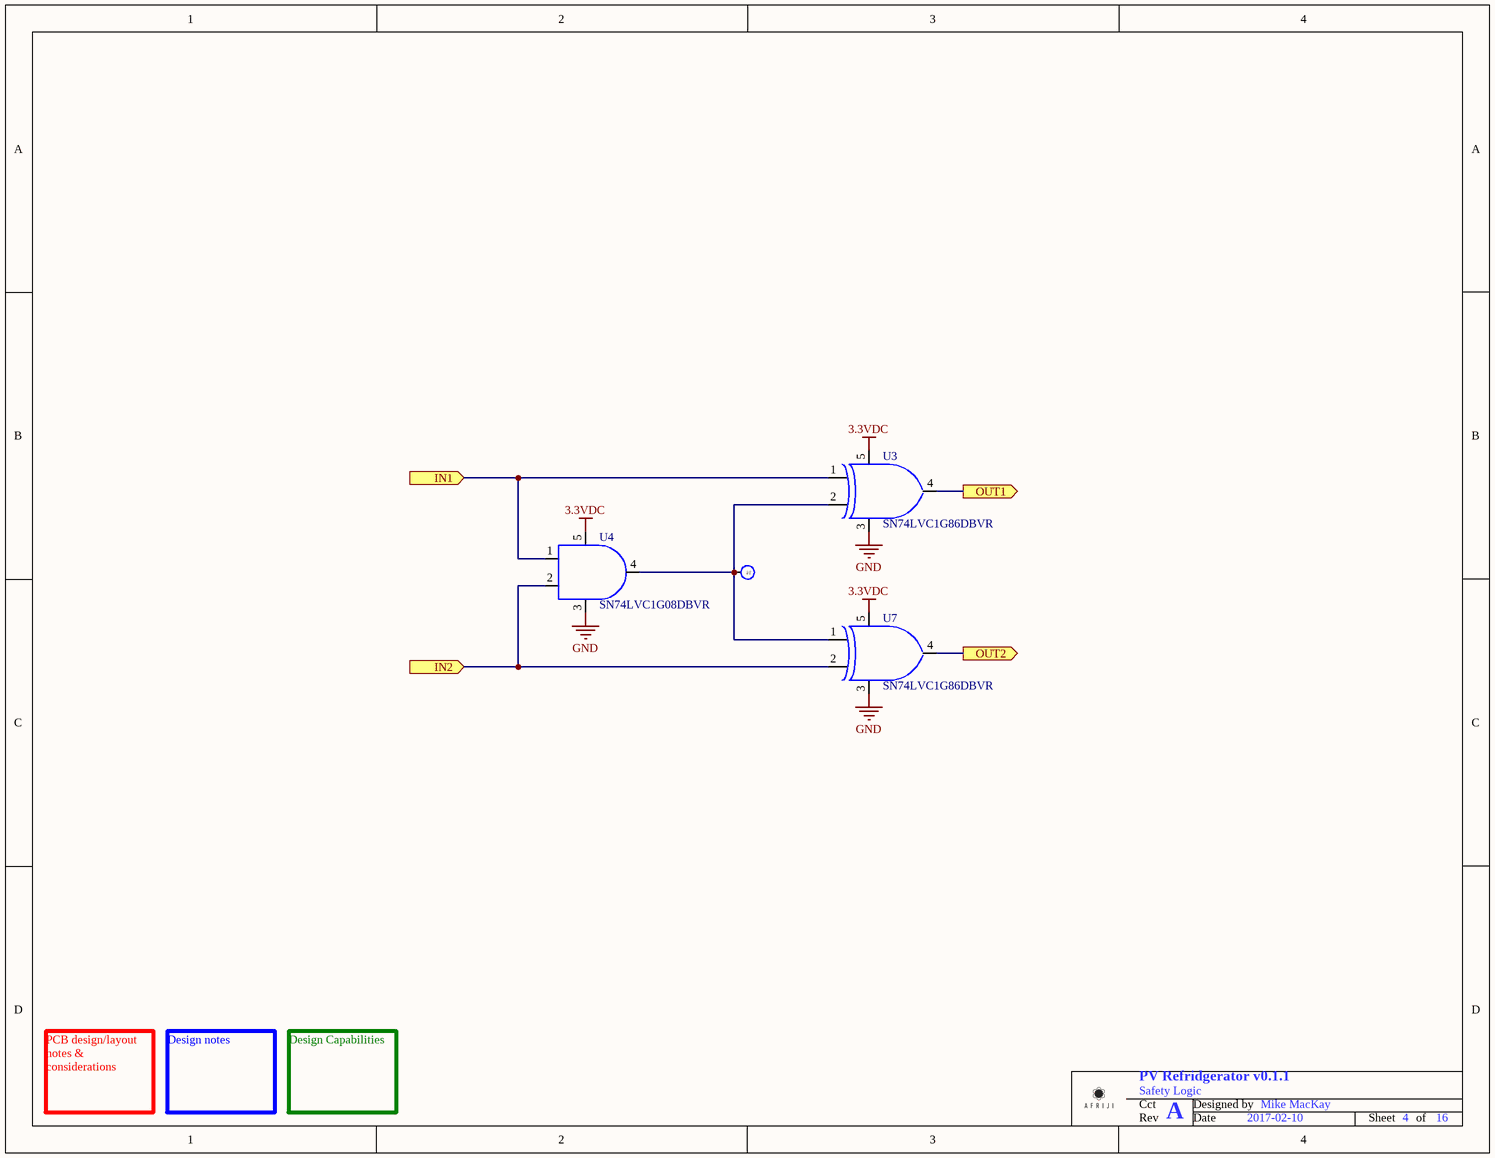
[diagram p7: Safety Logic.SchDoc]

### Parts
TP4  Test Clip  [SMT Test Clip]  (value not drawn)
U3  Manufacturer Part Number: SN74LVC1G86DBVR  [SOT23-5]  (hidden comment: Single XOR Logic Gate)
U4  Manufacturer Part Number: SN74LVC1G08DBVR  [SOT23-5]  (hidden comment: Single AND Logic Gate)
U7  Manufacturer Part Number: SN74LVC1G86DBVR  [SOT23-5]  (hidden comment: Single XOR Logic Gate)

### Ports
IN1 (in), IN2 (in), OUT1 (out), OUT2 (out)

### Nets
3.3VDC: U3.5(Vcc) U4.5(Vcc) U7.5(Vcc)
GND: U3.3(Gnd) U4.3(Gnd) U7.3(Gnd)
IN1: U3.1(A) U4.1(A) ; port IN1
IN2: U4.2(B) U7.2(B) ; port IN2
OUT1: U3.4(Y) ; port OUT1
OUT2: U7.4(Y) ; port OUT2
NetTP4_1: TP4.1 U3.2(B) U4.4(Y) U7.1(A)

### Channels
Safety Logic: designators end in A; ports IN1=NetU1_52 IN2=NetU1_53 OUT1=NetU3A_4 OUT2=NetU7A_4
Safety Logic: designators end in B; ports IN1=NetU1_4 IN2=NetU1_5 OUT1=NetU3B_4 OUT2=NetU7B_4

### Notes on the sheet
- PCB design/layout notes & considerations
- Design notes
- Design Capabilities
- Cct
- Designed by
- Rev
- Date
- Sheet
- of
- (in symbol Test Clip) Clip; Test

### Library data of the parts
TP4 = Test Clip: as TP1 on sheet Microcontroller; Technology: SMT; Supplier 1: Digi-Key; RoHS: RoHS Compliant; Category: Test and Measurement; Stock 1: 58926; Pricing 1: 1=0.31, 10=0.291, 25=0.248, 50=0.217, 100=0.2014, 250=0.1782, 500=0.17046, 1000=0.13947 (CAD); Packaging: Cut Tape (CT); Part Status: Active; Type: PC Test Point; Mounting Type: Surface Mount; Color: Natural; Size / Dimension: 0.063" x 0.031" x 0.045" (1.60mm x 0.80mm x 1.15mm); Plating: -; Material - Body: -; ComponentLink1URL: http://www.te.com/commerce/DocumentDelivery/DDEController?Action=srchrtrv&DocNm=1773266&DocType=DS&DocLang=English; ComponentLink1Description: Spec Sheet; Supplier Part Number 1: A106145CT-ND
U3 U7 = Single XOR Logic Gate: Manufacturer: Texas Instruments; Logic Type: XOR (Exclusive OR); Number of Circuits: 1; Number of Inputs: 2; Voltage - Supply: 1.65 V ~ 5.5 V; Current - Quiescent (Max): 10µA; Current - Output High, Low: 32mA, 32mA; Logic Level - Low: 0.7 V ~ 0.8 V; Logic Level - High: 1.7 V ~ 2 V; Max Propagation Delay @ V, Max CL: 4ns @ 5V, 50pF; Supplier 1: Digi-Key; RoHS: RoHS Compliant; Category: Integrated Circuits (ICs); Stock 1: 19977; Pricing 1: 1=0.36, 10=0.29, 100=0.198, 500=0.1482, 1000=0.111 (USD); Packaging: Cut Tape (CT); Part Status: Active; Features: -; Operating Temperature: -40°C ~ 125°C; Mounting Type: Surface Mount; Supplier Device Package: SOT-23-5; Package / Case: SC-74A, SOT-753; ComponentLink1URL: http://www.ti.com/lit/ds/symlink/sn74lvc1g86.pdf; ComponentLink1Description: Spec Sheet; Supplier Part Number 1: 296-9853-1-ND
U4 = Single AND Logic Gate: Manufacturer: Texas Instruments; Logic Type: AND Gate; Number of Circuits: 1; Number of Inputs: 2; Voltage - Supply: 1.65 V ~ 5.5 V; Current - Quiescent (Max): 10µA; Current - Output High, Low: 32mA, 32mA; Max Propagation Delay @ V, Max CL: 4ns @ 5V, 50pF; Value: Single AND Logic Gate; Supplier 1: Digi-Key; Supplier Part Number 1: 296-11601-1-ND; RoHS: RoHS Compliant; Category: Integrated Circuits (ICs); Stock 1: 17122; Pricing 1: 1=0.42, 10=0.315, 100=0.196, 500=0.134, 1000=0.103 (USD); Packaging: Cut Tape (CT); Part Status: Active; Features: -; Logic Level - Low: -; Logic Level - High: -; Operating Temperature: -40°C ~ 125°C; Mounting Type: Surface Mount; Supplier Device Package: SOT-23-5; Package / Case: SC-74A, SOT-753; ComponentLink1URL: http://www.ti.com/lit/ds/symlink/sn74lvc1g08.pdf; ComponentLink1Description: Spec Sheet

## Nets that join several sheets
3.3VDC: 3.3VDC Powersupply (C12.1 U5.3), Microcontroller (9 pins), ICSP (J4.5 J5.2 R4.1), Safety Logic (U3A.5 U4A.5 U7A.5), Safety Logic (U3B.5 U4B.5 U7B.5)
+Vsolar: Overview (J3.1 NetTie7.2), High Current H-Bridge (Q1.3 Q2.3)
GND: Overview (NetTie2.1 NetTie3.2), 3.3VDC Powersupply (C11.2 C12.2 J9.1 U5.2), Microcontroller (10 pins), ICSP (J4.4 J5.3), 15VDC Powersupply (J11.1), Safety Logic (U3A.3 U4A.3 U7A.3), Safety Logic (U3B.3 U4B.3 U7B.3)
+VT1.P: Overview (NetTie8.2), High Current H-Bridge (C1.1 Q1.2 Q3.3)
-VT1.P: Overview (NetTie9.2), High Current H-Bridge (C1.2 Q2.2 Q4.3)
C_VS: Overview (J6.1), High Voltage H-Bridge (C2.1 C3.1 Q5.2 Q7.3)
D_VS: Overview (J6.2), High Voltage H-Bridge (C2.2 C3.2 Q6.2 Q8.3)
MCLR: Microcontroller (U1.7), ICSP (R5.2)
NetU1_4: Microcontroller (U1.4), Safety Logic (U3B.1 U4B.1)
NetU1_5: Microcontroller (U1.5), Safety Logic (U4B.2 U7B.2)
NetU1_52: Microcontroller (U1.52), Safety Logic (U3A.1 U4A.1)
NetU1_53: Microcontroller (U1.53), Safety Logic (U4A.2 U7A.2)
PGC: Microcontroller (U1.11), ICSP (R7.2)
PGD: Microcontroller (U1.12), ICSP (R6.2)